# EAGLE design XibecaModuleBottom (EAGLE 9.6.2)
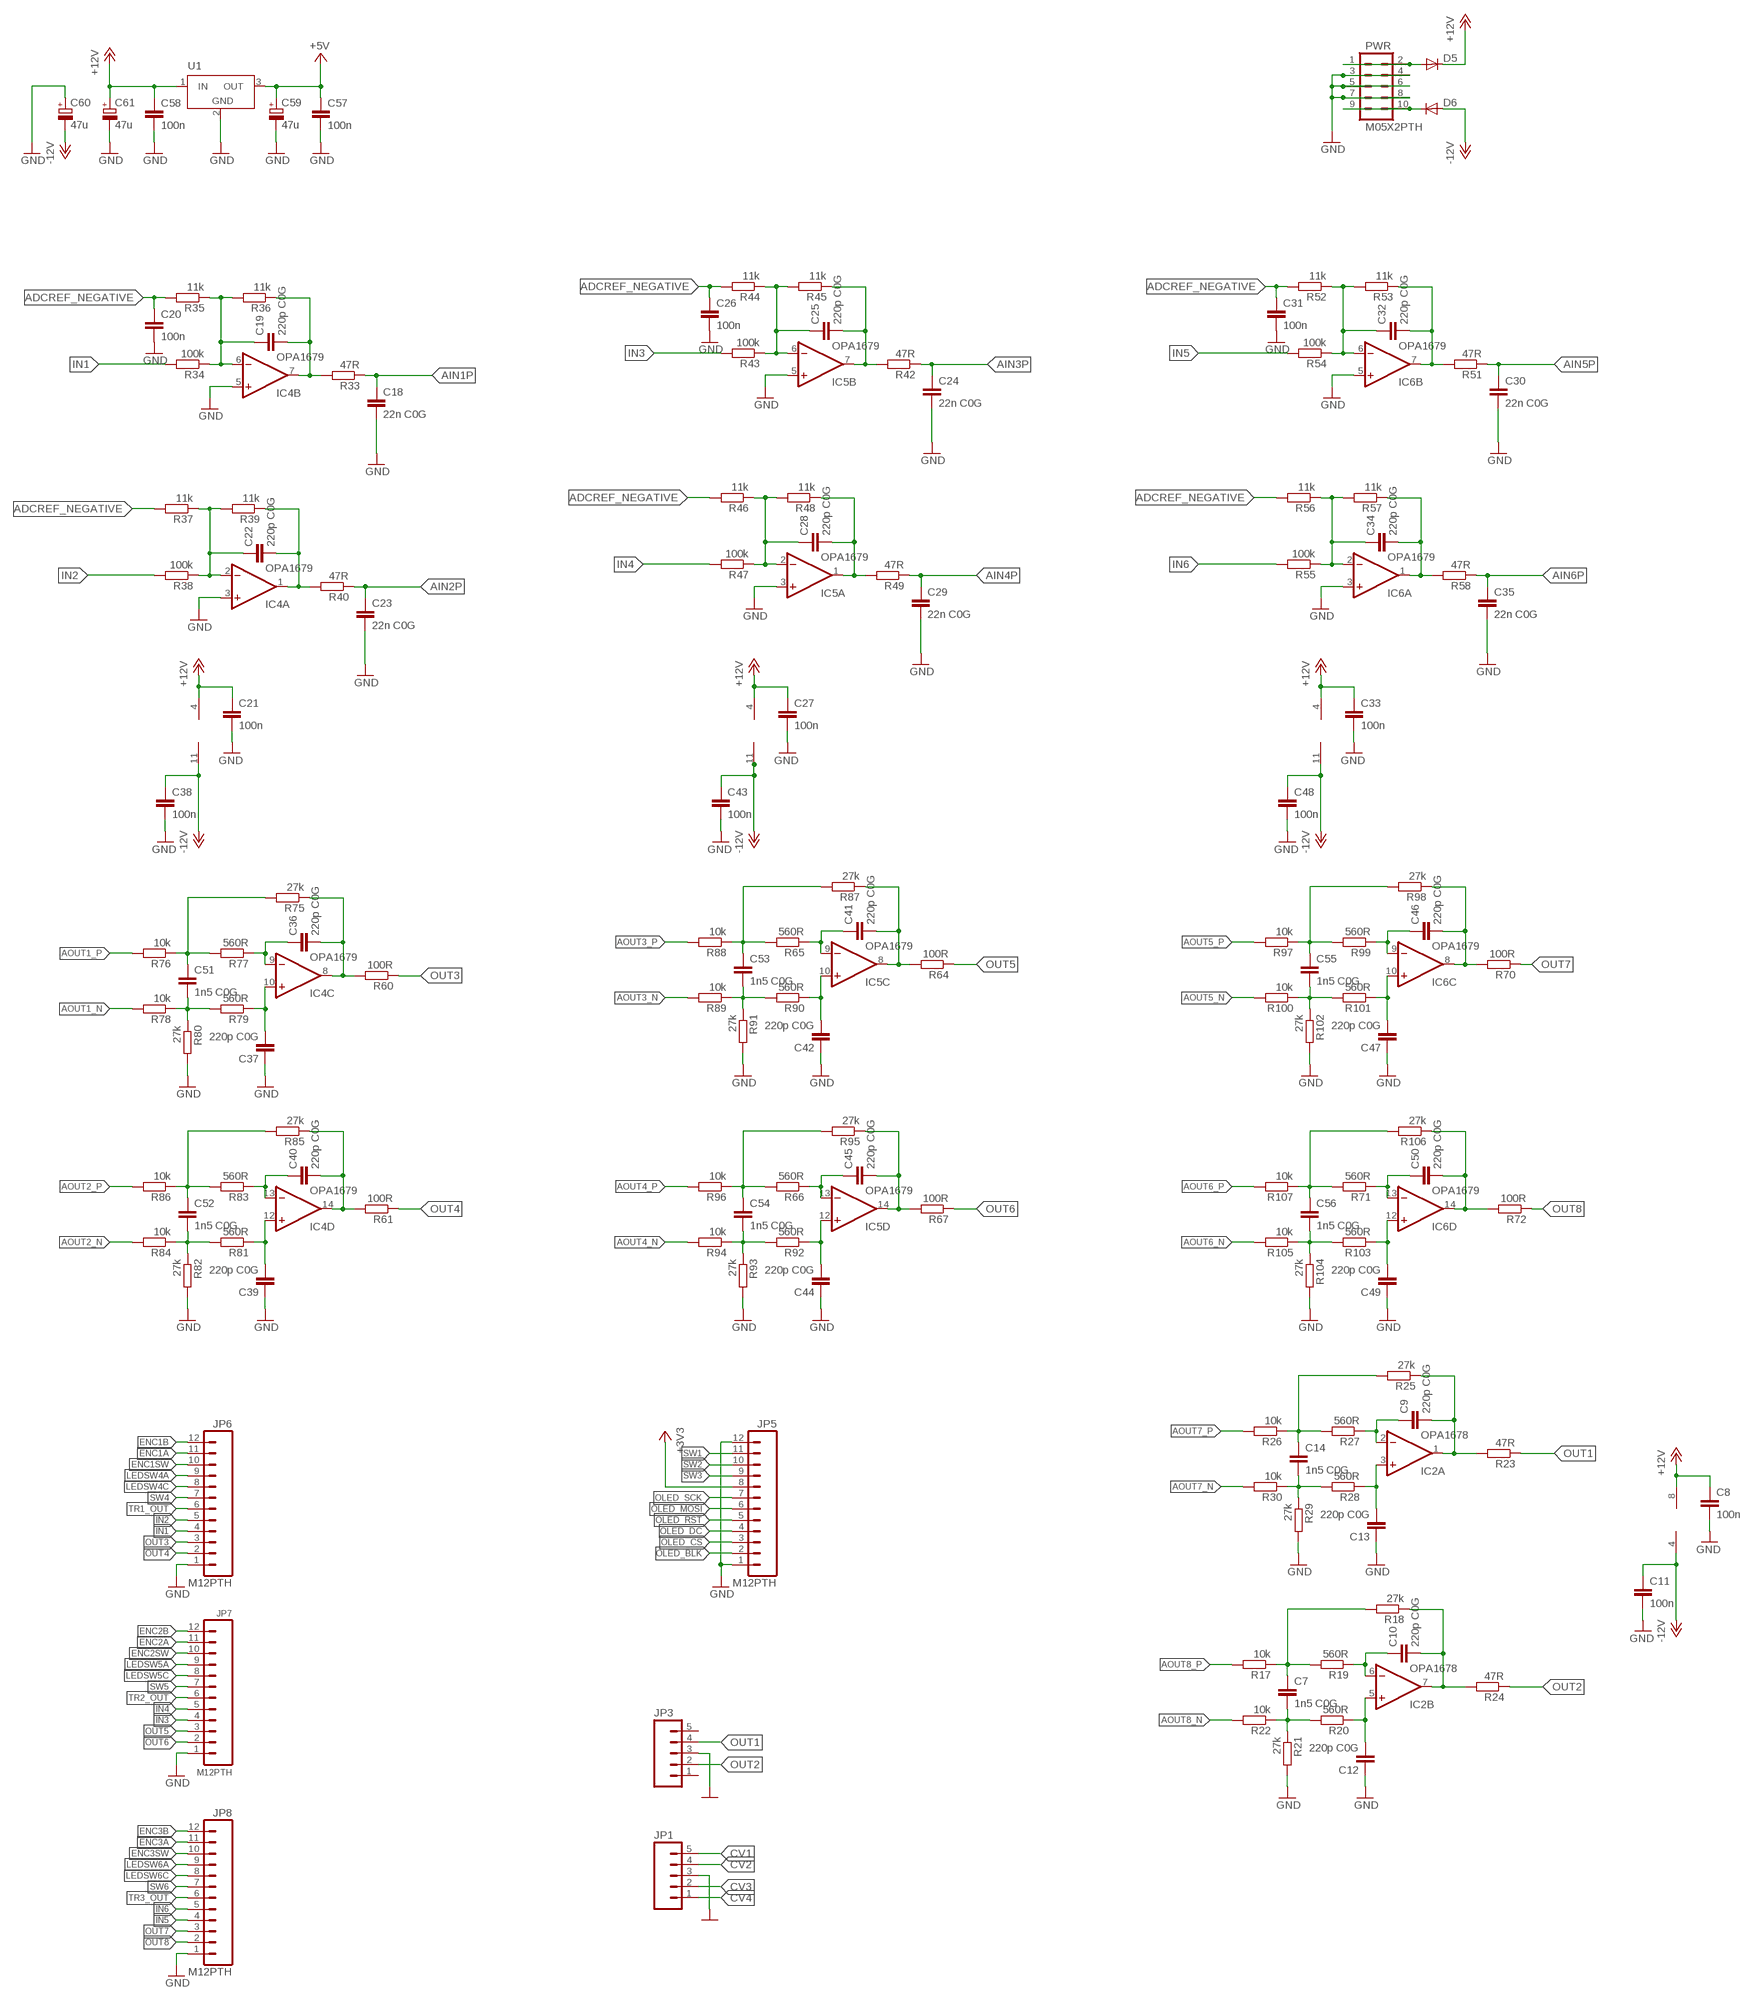
[diagram p0: schematic, sheet 1, part 1 of 2]
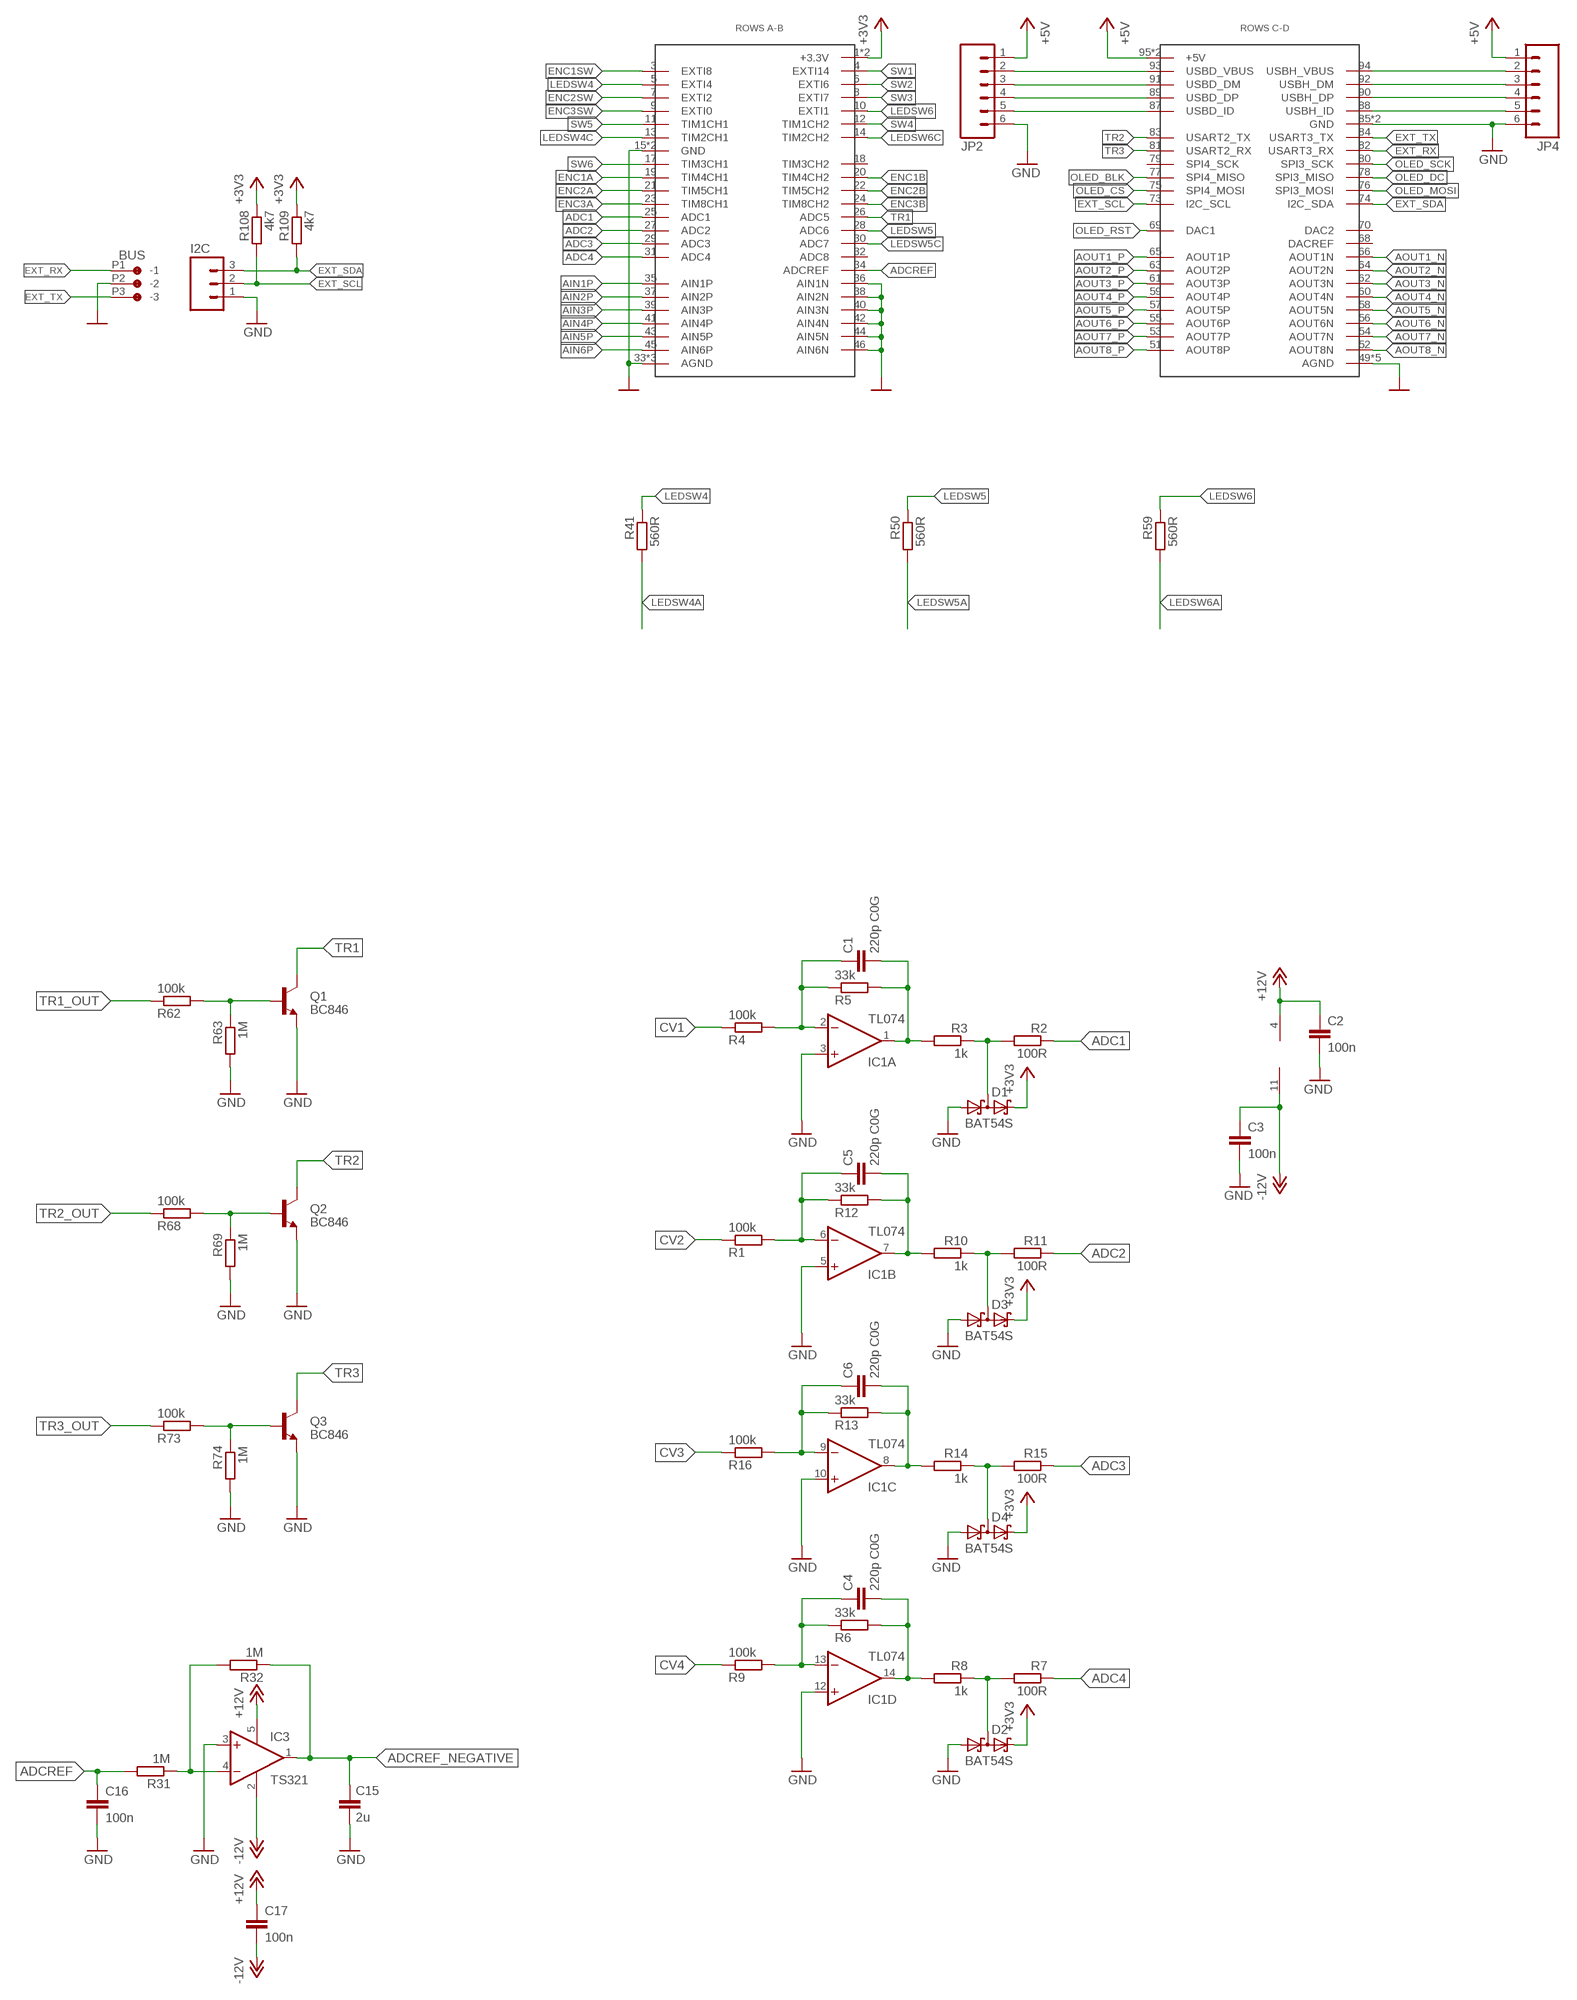
[diagram p1: schematic, sheet 1, part 2 of 2]

## Parts
BUS  CON-JST_PH_3W  [CON-JST_PH_3W]
C1  220p C0G  C-EUC0603  [C0603]
C2  100n  C-EUC0603  [C0603]
C3  100n  C-EUC0603  [C0603]
C4  220p C0G  C-EUC0603  [C0603]
C5  220p C0G  C-EUC0603  [C0603]
C6  220p C0G  C-EUC0603  [C0603]
C7  1n5 C0G  C-EUC0603  [C0603]
C8  100n  C-EUC0603  [C0603]
C9  220p C0G  C-EUC0603  [C0603]
C10  220p C0G  C-EUC0603  [C0603]
C11  100n  C-EUC0603  [C0603]
C12  220p C0G  C-EUC0603  [C0603]
C13  220p C0G  C-EUC0603  [C0603]
C14  1n5 C0G  C-EUC0603  [C0603]
C15  2u  C-EUC0603  [C0603]
C16  100n  C-EUC0603  [C0603]
C17  100n  C-EUC0603  [C0603]
C18  22n C0G  C-EUC0603  [C0603]
C19  220p C0G  C-EUC0603  [C0603]
C20  100n  C-EUC0603  [C0603]
C21  100n  C-EUC0603  [C0603]
C22  220p C0G  C-EUC0603  [C0603]
C23  22n C0G  C-EUC0603  [C0603]
C24  22n C0G  C-EUC0603  [C0603]
C25  220p C0G  C-EUC0603  [C0603]
C26  100n  C-EUC0603  [C0603]
C27  100n  C-EUC0603  [C0603]
C28  220p C0G  C-EUC0603  [C0603]
C29  22n C0G  C-EUC0603  [C0603]
C30  22n C0G  C-EUC0603  [C0603]
C31  100n  C-EUC0603  [C0603]
C32  220p C0G  C-EUC0603  [C0603]
C33  100n  C-EUC0603  [C0603]
C34  220p C0G  C-EUC0603  [C0603]
C35  22n C0G  C-EUC0603  [C0603]
C36  220p C0G  C-EUC0603  [C0603]
C37  220p C0G  C-EUC0603  [C0603]
C38  100n  C-EUC0603  [C0603]
C39  220p C0G  C-EUC0603  [C0603]
C40  220p C0G  C-EUC0603  [C0603]
C41  220p C0G  C-EUC0603  [C0603]
C42  220p C0G  C-EUC0603  [C0603]
C43  100n  C-EUC0603  [C0603]
C44  220p C0G  C-EUC0603  [C0603]
C45  220p C0G  C-EUC0603  [C0603]
C46  220p C0G  C-EUC0603  [C0603]
C47  220p C0G  C-EUC0603  [C0603]
C48  100n  C-EUC0603  [C0603]
C49  220p C0G  C-EUC0603  [C0603]
C50  220p C0G  C-EUC0603  [C0603]
C51  1n5 C0G  C-EUC0603  [C0603]
C52  1n5 C0G  C-EUC0603  [C0603]
C53  1n5 C0G  C-EUC0603  [C0603]
C54  1n5 C0G  C-EUC0603  [C0603]
C55  1n5 C0G  C-EUC0603  [C0603]
C56  1n5 C0G  C-EUC0603  [C0603]
C57  100n  C-EUC0603  [C0603]
C58  100n  C-EUC0603  [C0603]
C59  47u  CPOL-EUE5-8.5  [E5-8,5]
C60  47u  CPOL-EUE5-8.5  [E5-8,5]
C61  47u  CPOL-EUE5-8.5  [E5-8,5]
D1  BAT54S  [SOT23]
D2  BAT54S  [SOT23]
D3  BAT54S  [SOT23]
D4  BAT54S  [SOT23]
D5  DIODE1N4001  [DIODE-1N4001]
D6  DIODE1N4001  [DIODE-1N4001]
I2C  M03PTH  [1X03]
IC1  TL074  QUAD_OPAMPD  [SO14]
IC2  OPA1678  TL072D  [SO08]
IC3  TS321  OPA725DBV  [SOT23-5]
IC4  OPA1679  TL074D  [SO14]
IC5  OPA1679  TL074D  [SO14]
IC6  OPA1679  TL074D  [SO14]
JP1  M05PTH  [1X05]
JP2  M06SIP  [1X06]
JP3  M05PTH  [1X05]
JP4  M06SIP  [1X06]
JP5  M12PTH  [1X12]
JP6  M12PTH  [1X12]
JP7  M12PTH  [1X12]
JP8  M12PTH  [1X12]
PWR  M05X2PTH  [AVR_ICSP]
Q1  BC846  [SOT23]
Q2  BC846  [SOT23]
Q3  BC846  [SOT23]
R1  100k  R-EU_R0603  [0603]
R2  100R  R-EU_R0603  [0603]
R3  1k  R-EU_R0603  [0603]
R4  100k  R-EU_R0603  [0603]
R5  33k  R-EU_R0603  [0603]
R6  33k  R-EU_R0603  [0603]
R7  100R  R-EU_R0603  [0603]
R8  1k  R-EU_R0603  [0603]
R9  100k  R-EU_R0603  [0603]
R10  1k  R-EU_R0603  [0603]
R11  100R  R-EU_R0603  [0603]
R12  33k  R-EU_R0603  [0603]
R13  33k  R-EU_R0603  [0603]
R14  1k  R-EU_R0603  [0603]
R15  100R  R-EU_R0603  [0603]
R16  100k  R-EU_R0603  [0603]
R17  10k  R-EU_R0603  [0603]
R18  27k  R-EU_R0603  [0603]
R19  560R  R-EU_R0603  [0603]
R20  560R  R-EU_R0603  [0603]
R21  27k  R-EU_R0603  [0603]
R22  10k  R-EU_R0603  [0603]
R23  47R  R-EU_R0603  [0603]
R24  47R  R-EU_R0603  [0603]
R25  27k  R-EU_R0603  [0603]
R26  10k  R-EU_R0603  [0603]
R27  560R  R-EU_R0603  [0603]
R28  560R  R-EU_R0603  [0603]
R29  27k  R-EU_R0603  [0603]
R30  10k  R-EU_R0603  [0603]
R31  1M  R-EU_R0603  [0603]
R32  1M  R-EU_R0603  [0603]
R33  47R  R-EU_R0603  [0603]
R34  100k  R-EU_R0603  [0603]
R35  11k  R-EU_R0603  [0603]
R36  11k  R-EU_R0603  [0603]
R37  11k  R-EU_R0603  [0603]
R38  100k  R-EU_R0603  [0603]
R39  11k  R-EU_R0603  [0603]
R40  47R  R-EU_R0603  [0603]
R41  560R  R-EU_R0603  [0603]
R42  47R  R-EU_R0603  [0603]
R43  100k  R-EU_R0603  [0603]
R44  11k  R-EU_R0603  [0603]
R45  11k  R-EU_R0603  [0603]
R46  11k  R-EU_R0603  [0603]
R47  100k  R-EU_R0603  [0603]
R48  11k  R-EU_R0603  [0603]
R49  47R  R-EU_R0603  [0603]
R50  560R  R-EU_R0603  [0603]
R51  47R  R-EU_R0603  [0603]
R52  11k  R-EU_R0603  [0603]
R53  11k  R-EU_R0603  [0603]
R54  100k  R-EU_R0603  [0603]
R55  100k  R-EU_R0603  [0603]
R56  11k  R-EU_R0603  [0603]
R57  11k  R-EU_R0603  [0603]
R58  47R  R-EU_R0603  [0603]
R59  560R  R-EU_R0603  [0603]
R60  100R  R-EU_R0603  [0603]
R61  100R  R-EU_R0603  [0603]
R62  100k  R-EU_R0603  [0603]
R63  1M  R-EU_R0603  [0603]
R64  100R  R-EU_R0603  [0603]
R65  560R  R-EU_R0603  [0603]
R66  560R  R-EU_R0603  [0603]
R67  100R  R-EU_R0603  [0603]
R68  100k  R-EU_R0603  [0603]
R69  1M  R-EU_R0603  [0603]
R70  100R  R-EU_R0603  [0603]
R71  560R  R-EU_R0603  [0603]
R72  100R  R-EU_R0603  [0603]
R73  100k  R-EU_R0603  [0603]
R74  1M  R-EU_R0603  [0603]
R75  27k  R-EU_R0603  [0603]
R76  10k  R-EU_R0603  [0603]
R77  560R  R-EU_R0603  [0603]
R78  10k  R-EU_R0603  [0603]
R79  560R  R-EU_R0603  [0603]
R80  27k  R-EU_R0603  [0603]
R81  560R  R-EU_R0603  [0603]
R82  27k  R-EU_R0603  [0603]
R83  560R  R-EU_R0603  [0603]
R84  10k  R-EU_R0603  [0603]
R85  27k  R-EU_R0603  [0603]
R86  10k  R-EU_R0603  [0603]
R87  27k  R-EU_R0603  [0603]
R88  10k  R-EU_R0603  [0603]
R89  10k  R-EU_R0603  [0603]
R90  560R  R-EU_R0603  [0603]
R91  27k  R-EU_R0603  [0603]
R92  560R  R-EU_R0603  [0603]
R93  27k  R-EU_R0603  [0603]
R94  10k  R-EU_R0603  [0603]
R95  27k  R-EU_R0603  [0603]
R96  10k  R-EU_R0603  [0603]
R97  10k  R-EU_R0603  [0603]
R98  27k  R-EU_R0603  [0603]
R99  560R  R-EU_R0603  [0603]
R100  10k  R-EU_R0603  [0603]
R101  560R  R-EU_R0603  [0603]
R102  27k  R-EU_R0603  [0603]
R103  560R  R-EU_R0603  [0603]
R104  27k  R-EU_R0603  [0603]
R105  10k  R-EU_R0603  [0603]
R106  27k  R-EU_R0603  [0603]
R107  10k  R-EU_R0603  [0603]
R108  4k7  R-EU_R0603  [0603]
R109  4k7  R-EU_R0603  [0603]
U1  TSR-1-2450  [TSR-1-2450]
U$2  NOCTUA2NOCTUA2  [NOCTUA]

## Nets
+3V3: D1.2(C2) D2.2(C2) D3.2(C2) D4.2(C2) JP5.8 R108.1 R109.1 U$2.1(+3.3V) U$2.2(+3.3V)
+5V: C57.1 C59.+ JP2.1 JP4.1 U1.3(OUT) U$2.95(+5V) U$2.96(+5V)
+12V: C2.1 C8.1 C17.1 C21.1 C27.1 C33.1 C58.1 C61.+ D5.C IC1.4(P:V+) IC2.8(P:V+) IC3.5(V+) IC4.4(P:V+) IC5.4(P:V+) IC6.4(P:V+) U1.1(IN)
-12V: C3.1 C11.1 C17.2 C38.1 C43.1 C48.1 C60.- D6.A IC1.11(P:V-) IC2.4(P:V-) IC3.2(V-) IC4.11(P:V-) IC5.11(P:V-) IC6.11(P:V-)
ADC1: R2.1 U$2.25(ADC1)
ADC2: R11.1 U$2.27(ADC2)
ADC3: R15.1 U$2.29(ADC3)
ADC4: R7.1 U$2.31(ADC4)
ADCREF: C16.1 R31.2 U$2.34(ADCREF)
ADCREF_NEGATIVE: C15.1 C20.1 C26.1 C31.1 IC3.1(OUT) R32.1 R35.2 R37.2 R44.2 R46.2 R52.2 R56.2
AIN1P: C18.1 R33.1 U$2.35(AIN1P)
AIN2P: C23.1 R40.1 U$2.37(AIN2P)
AIN3P: C24.1 R42.1 U$2.39(AIN3P)
AIN4P: C29.1 R49.1 U$2.41(AIN4P)
AIN5P: C30.1 R51.1 U$2.43(AIN5P)
AIN6P: C35.1 R58.1 U$2.45(AIN6P)
AOUT1_N: R78.2 U$2.66(AOUT1N)
AOUT1_P: R76.2 U$2.65(AOUT1P)
AOUT2_N: R84.2 U$2.64(AOUT2N)
AOUT2_P: R86.2 U$2.63(AOUT2P)
AOUT3_N: R89.2 U$2.62(AOUT3N)
AOUT3_P: R88.2 U$2.61(AOUT3P)
AOUT4_N: R94.2 U$2.60(AOUT4N)
AOUT4_P: R96.2 U$2.59(AOUT4P)
AOUT5_N: R100.2 U$2.58(AOUT5N)
AOUT5_P: R97.2 U$2.57(AOUT5P)
AOUT6_N: R105.2 U$2.56(AOUT6N)
AOUT6_P: R107.2 U$2.55(AOUT6P)
AOUT7_N: R30.2 U$2.54(AOUT7N)
AOUT7_P: R26.2 U$2.53(AOUT7P)
AOUT8_N: R22.2 U$2.52(AOUT8N)
AOUT8_P: R17.2 U$2.51(AOUT8P)
CV1: JP1.5 R4.1
CV2: JP1.4 R1.1
CV3: JP1.2 R16.1
CV4: JP1.1 R9.1
ENC1A: JP6.11 U$2.19(TIM4CH1)
ENC1B: JP6.12 U$2.20(TIM4CH2)
ENC1SW: JP6.10 U$2.3(EXTI8)
ENC2A: JP7.11 U$2.21(TIM5CH1)
ENC2B: JP7.12 U$2.22(TIM5CH2)
ENC2SW: JP7.10 U$2.7(EXTI2)
ENC3A: JP8.11 U$2.23(TIM8CH1)
ENC3B: JP8.12 U$2.24(TIM8CH2)
ENC3SW: JP8.10 U$2.9(EXTI0)
EXT_RX: BUS.P1(-1) U$2.82(USART3_RX)
EXT_SCL: I2C.2 R108.2 U$2.73(I2C_SCL)
EXT_SDA: I2C.3 R109.2 U$2.74(I2C_SDA)
EXT_TX: BUS.P3(-3) U$2.84(USART3_TX)
GND: BUS.P2(-2) C2.2 C3.2 C8.2 C11.2 C12.1 C13.1 C15.2 C16.2 C18.2 C20.2 C21.2 C23.2 C24.2 C26.2 C27.2 C29.2 C30.2 C31.2 C33.2 C35.2 C37.1 C38.2 C39.1 C42.1 C43.2 C44.1 C47.1 C48.2 C49.1 C57.2 C58.2 C59.- C60.+ C61.- D1.1(A1) D2.1(A1) D3.1(A1) D4.1(A1) I2C.1 IC1.3(A:+IN) IC1.5(B:+IN) IC1.10(C:+IN) IC1.12(D:+IN) IC3.3(+IN) IC4.3(A:+IN) IC4.5(B:+IN) IC5.3(A:+IN) IC5.5(B:+IN) IC6.3(A:+IN) IC6.5(B:+IN) JP1.3 JP2.6 JP3.3 JP4.6 JP5.1 JP5.12 JP6.1 JP7.1 JP8.1 PWR.3 PWR.4 PWR.5 PWR.6 PWR.7 PWR.8 Q1.2(E) Q2.2(E) Q3.2(E) R21.2 R29.2 R63.2 R69.2 R74.2 R80.2 R82.2 R91.2 R93.2 R102.2 R104.2 U1.2(GND) U$2.15(GND) U$2.16(GND) U$2.33(AGND) U$2.36(AIN1N) U$2.38(AIN2N) U$2.40(AIN3N) U$2.42(AIN4N) U$2.44(AIN5N) U$2.46(AIN6N) U$2.47(AGND) U$2.48(AGND) U$2.49(AGND) U$2.50(AGND) U$2.67(AGND) U$2.71(AGND) U$2.72(AGND) U$2.85(GND) U$2.86(GND)
IN1: JP6.4 R34.2
IN2: JP6.5 R38.2
IN3: JP7.4 R43.2
IN4: JP7.5 R47.2
IN5: JP8.4 R54.2
IN6: JP8.5 R55.2
LEDSW4: R41.1 U$2.5(EXTI4)
LEDSW4A: JP6.9 R41.2
LEDSW4C: JP6.8 U$2.13(TIM2CH1)
LEDSW5: R50.1 U$2.28(ADC6)
LEDSW5A: JP7.9 R50.2
LEDSW5C: JP7.8 U$2.30(ADC7)
LEDSW6: R59.1 U$2.10(EXTI1)
LEDSW6A: JP8.9 R59.2
LEDSW6C: JP8.8 U$2.14(TIM2CH2)
N$1: C40.2 IC4.14(D:OUT) R61.2 R85.1
N$2: C52.2 R81.2 R82.1 R84.1
N$3: C52.1 R83.2 R85.2 R86.1
N$4: C22.2 IC4.1(A:OUT) R39.1 R40.2
N$5: C40.1 IC4.13(D:-IN) R83.1
N$6: C22.1 IC4.2(A:-IN) R37.1 R38.1 R39.2
N$7: D6.C PWR.9 PWR.10
N$8: C39.2 IC4.12(D:+IN) R81.1
N$9: D5.A PWR.1 PWR.2
N$10: C50.2 IC6.14(D:OUT) R72.2 R106.1
N$11: C53.2 R89.1 R90.2 R91.1
N$12: C53.1 R65.2 R87.2 R88.1
N$13: C41.1 IC5.9(C:-IN) R65.1
N$14: C42.2 IC5.10(C:+IN) R90.1
N$15: C41.2 IC5.8(C:OUT) R64.2 R87.1
N$16: C45.2 IC5.14(D:OUT) R67.2 R95.1
N$17: C25.2 IC5.7(B:OUT) R42.2 R45.1
N$18: C25.1 IC5.6(B:-IN) R43.1 R44.1 R45.2
N$20: C28.2 IC5.1(A:OUT) R48.1 R49.2
N$21: C28.1 IC5.2(A:-IN) R46.1 R47.1 R48.2
N$22: C46.2 IC6.8(C:OUT) R70.2 R98.1
N$23: C54.2 R92.2 R93.1 R94.1
N$24: C54.1 R66.2 R95.2 R96.1
N$25: C45.1 IC5.13(D:-IN) R66.1
N$26: C44.2 IC5.12(D:+IN) R92.1
N$27: IC3.4(-IN) R31.1 R32.2
N$28: C9.2 IC2.1(A:OUT) R23.2 R25.1
N$29: C14.2 R28.2 R29.1 R30.1
N$30: Q1.1(B) R62.2 R63.1
N$31: C14.1 R25.2 R26.1 R27.2
N$32: C10.2 IC2.7(B:OUT) R18.1 R24.2
N$35: C55.2 R100.1 R101.2 R102.1
N$36: C55.1 R97.1 R98.2 R99.2
N$37: C46.1 IC6.9(C:-IN) R99.1
N$38: C47.2 IC6.10(C:+IN) R101.1
N$39: C36.2 IC4.8(C:OUT) R60.2 R75.1
N$40: Q2.1(B) R68.2 R69.1
N$41: C32.2 IC6.7(B:OUT) R51.2 R53.1
N$42: C32.1 IC6.6(B:-IN) R52.1 R53.2 R54.1
N$44: C34.2 IC6.1(A:OUT) R57.1 R58.2
N$45: C34.1 IC6.2(A:-IN) R55.1 R56.1 R57.2
N$47: C56.2 R103.2 R104.1 R105.1
N$48: C56.1 R71.2 R106.2 R107.1
N$49: C50.1 IC6.13(D:-IN) R71.1
N$50: C49.2 IC6.12(D:+IN) R103.1
N$52: C5.1 IC1.6(B:-IN) R1.2 R12.1
N$57: C1.1 IC1.2(A:-IN) R4.2 R5.1
N$59: Q3.1(B) R73.2 R74.1
N$60: C9.1 IC2.2(A:-IN) R27.1
N$61: C13.2 IC2.3(A:+IN) R28.1
N$63: C7.2 R20.2 R21.1 R22.1
N$64: C7.1 R17.1 R18.2 R19.2
N$65: C10.1 IC2.6(B:-IN) R19.1
N$66: C12.2 IC2.5(B:+IN) R20.1
N$68: C1.2 IC1.1(A:OUT) R3.2 R5.2
N$69: D1.3(C1A2) R2.2 R3.1
N$70: C5.2 IC1.7(B:OUT) R10.2 R12.2
N$71: D3.3(C1A2) R10.1 R11.2
N$72: C6.1 IC1.9(C:-IN) R13.1 R16.2
N$73: C6.2 IC1.8(C:OUT) R13.2 R14.2
N$74: D4.3(C1A2) R14.1 R15.2
N$75: C4.1 IC1.13(D:-IN) R6.1 R9.2
N$76: C4.2 IC1.14(D:OUT) R6.2 R8.2
N$77: D2.3(C1A2) R7.2 R8.1
N$78: JP2.2 U$2.93(USBD_VBUS)
N$79: JP2.3 U$2.91(USBD_DM)
N$80: JP2.4 U$2.89(USBD_DP)
N$81: JP2.5 U$2.87(USBD_ID)
N$82: JP4.5 U$2.88(USBH_ID)
N$83: JP4.4 U$2.90(USBH_DP)
N$84: JP4.3 U$2.92(USBH_DM)
N$85: JP4.2 U$2.94(USBH_VBUS)
N$214: C51.2 R78.1 R79.2 R80.1
N$215: C51.1 R75.2 R76.1 R77.2
N$216: C36.1 IC4.9(C:-IN) R77.1
N$217: C37.2 IC4.10(C:+IN) R79.1
N$220: C19.2 IC4.7(B:OUT) R33.2 R36.1
N$223: C19.1 IC4.6(B:-IN) R34.1 R35.1 R36.2
OLED_BLK: JP5.2 U$2.77(SPI4_MISO)
OLED_CS: JP5.3 U$2.75(SPI4_MOSI)
OLED_DC: JP5.4 U$2.78(SPI3_MISO)
OLED_MOSI: JP5.6 U$2.76(SPI3_MOSI)
OLED_RST: JP5.5 U$2.69(DAC1)
OLED_SCK: JP5.7 U$2.80(SPI3_SCK)
OUT1: JP3.4 R23.1
OUT2: JP3.2 R24.1
OUT3: JP6.3 R60.1
OUT4: JP6.2 R61.1
OUT5: JP7.3 R64.1
OUT6: JP7.2 R67.1
OUT7: JP8.3 R70.1
OUT8: JP8.2 R72.1
SW1: JP5.11 U$2.4(EXTI14)
SW2: JP5.10 U$2.6(EXTI6)
SW3: JP5.9 U$2.8(EXTI7)
SW4: JP6.7 U$2.12(TIM1CH2)
SW5: JP7.7 U$2.11(TIM1CH1)
SW6: JP8.7 U$2.17(TIM3CH1)
TR1: Q1.3(C) U$2.26(ADC5)
TR1_OUT: JP6.6 R62.1
TR2: Q2.3(C) U$2.83(USART2_TX)
TR2_OUT: JP7.6 R68.1
TR3: Q3.3(C) U$2.81(USART2_RX)
TR3_OUT: JP8.6 R73.1
Unconnected: JP3.1 JP3.5 U$2.18(TIM3CH2) U$2.32(ADC8) U$2.68(DACREF) U$2.70(DAC2) U$2.79(SPI4_SCK)

## Library data of the parts
BUS = Rebel:CON-JST_PH_3W
C1-C58 = Rebel:C-EU: CAPACITOR, European symbol
C59-C61 = Rebel:CPOL-EU: POLARIZED CAPACITOR, European symbol
D1-D4 = diode:BAT54S: Schottky Diodes Pin connection corrected 2011-05-04 Source: Fairchild .. BAT54.pdf
D5 D6 = Rebel:DIODE: Diode These are standard reverse protection diodes and small signal diodes. SMA package can handle up to about 1A. SOD-323 can handle about 200mA. Watch the SOD-323 package when ordering, there are some mfgs out there that are 5-pin packages.
I2C = SparkFun:M03: Header 3 Standard 3-pin 0.1" header. Use with straight break away headers (SKU : PRT-00116), right angle break away headers (PRT-00553), swiss pins (PRT-00743), machine pins (PRT-00117), and female headers (PRT-00115). Molex polarized connector foot print use with SKU : PRT-08232 with associated crimp pins and housings.
IC1 = adafruit:QUAD_OPAMP: OP AMP Standard quad package
IC2 = linear:TL072: OP AMP
IC3 = linear:OPA725: Very Low Noise, High-Speed, 12V CMOS Operational Amplifier Source: http://focus.ti.com/lit/ds/symlink/opa725.pdf
IC4-IC6 = Rebel:TL074: OP AMP
JP1 JP3 = SparkFun:M05: Header 5 Standard 5-pin 0.1" header. Use with straight break away headers (SKU : PRT-00116), right angle break away headers (PRT-00553), swiss pins (PRT-00743), machine pins (PRT-00117), and female headers (PRT-00115). Molex polarized connector foot print use with SKU : PRT-08230 with associated crimp pins and housings.
JP2 JP4 = SparkFun:M06: Header 6 Standard 6-pin 0.1" header. Use with straight break away headers (SKU : PRT-00116), right angle break away headers (PRT-00553), swiss pins (PRT-00743), machine pins (PRT-00117), and female headers (PRT-00115). Molex polarized connector foot print use with SKU : PRT-08094 with associated crimp pins and housings. NOTES ON THE VARIANTS LOCK and LOCK_LONGPADS... This footprint was designed to help hold the alignment of a through-hole component (i.e. 6-pin header) while soldering it into place. You may notice that each hole has been shifted either up or down by 0.005 of an inch from it's more standard position (which is a perfectly straight line). This slight alteration caused the pins (the squares in the middle) to touch the edges of the holes. Because they are alternating, it causes a "brace" to hold the component in place. 0.005 has proven to be the perfect amount of "off-center" position when using our standard breakaway headers. Although looks a little odd when you look at the bare footprint, once you have a header in there, the alteration is very hard to notice. Also, if you push a header all the way into place, it is covered up entirely on the bottom side. This idea of altering the position of holes to aid alignment will be further integrated into the Sparkfun Library for other footprints. It can help hold any component with 3 or more connection pins.
JP5-JP8 = SparkFun:M12: Header 12 Standard 12-pin 0.1" header. Use with straight break away headers (SKU : PRT-00116), right angle break away headers (PRT-00553), swiss pins (PRT-00743), machine pins (PRT-00117), and female headers (PRT-00115).
PWR = SparkFun:M05X2: Header 5x2 Standard 10-pin dual row 0.1" header. Commonly used with AVR-ISP. Use with Spark Fun Electronics SKU: PRT-00778
Q1-Q3 = transistor:BC846: NPN TRANSISTOR
R1-R109 = Rebel:R-EU_: RESISTOR, European symbol
U1 = Hangar:TSR-1-2450
U$2 = Rebel platforms:NOCTUA2

## Net classes
1 power: width 0.178 mm, drill 0.305 mm, clearance 0.178 mm to class 0, clearance 0.178 mm

## Board
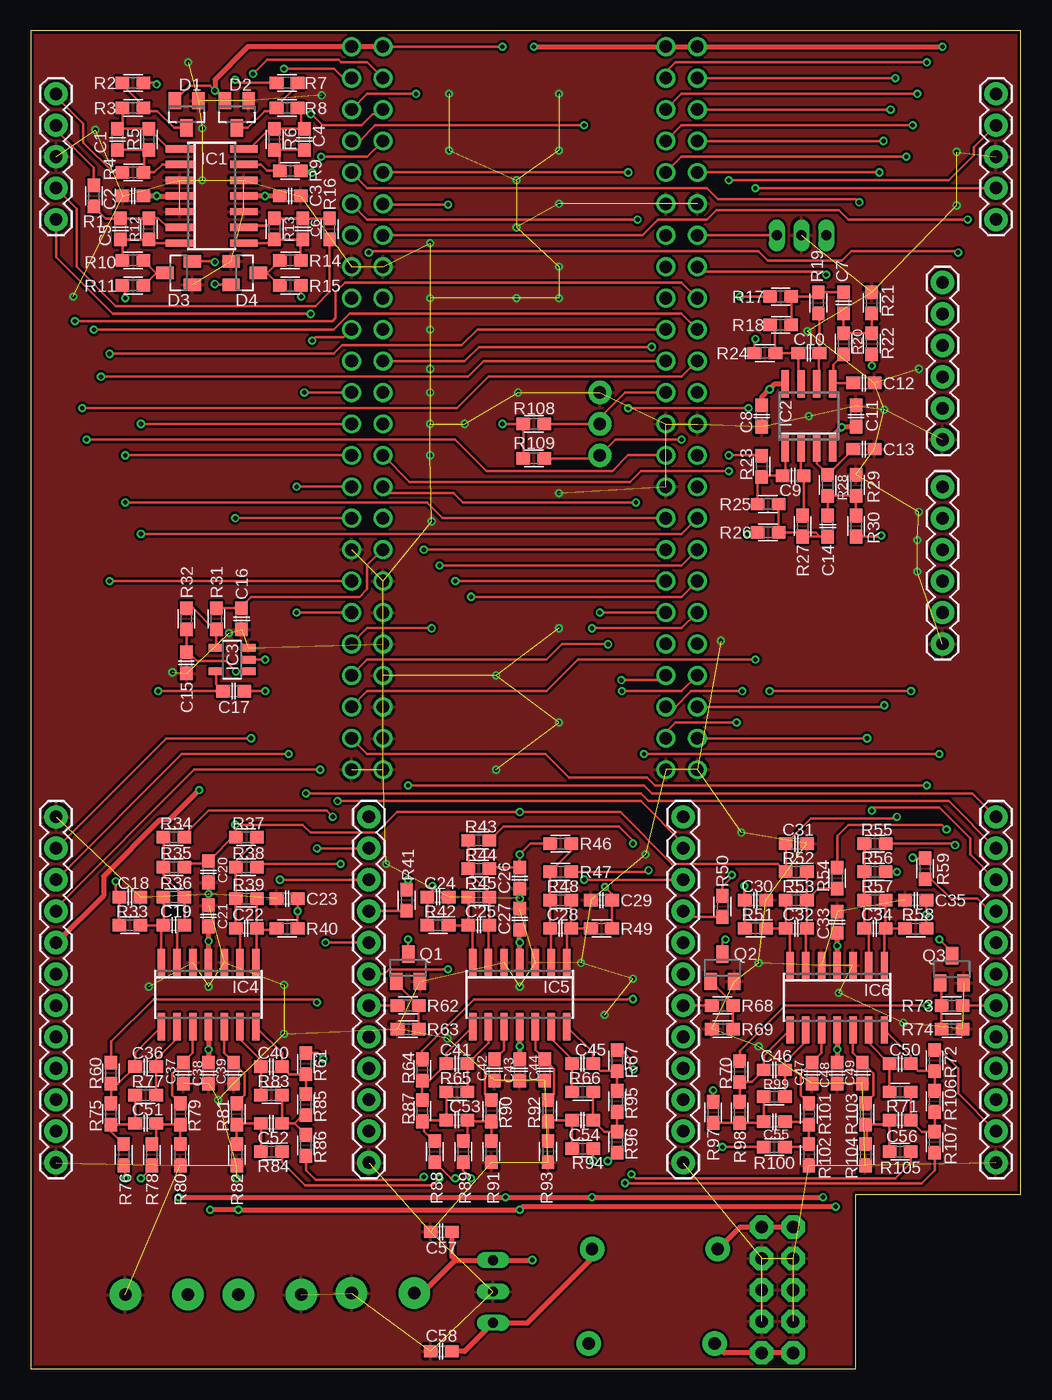
[diagram p2: board, top side]
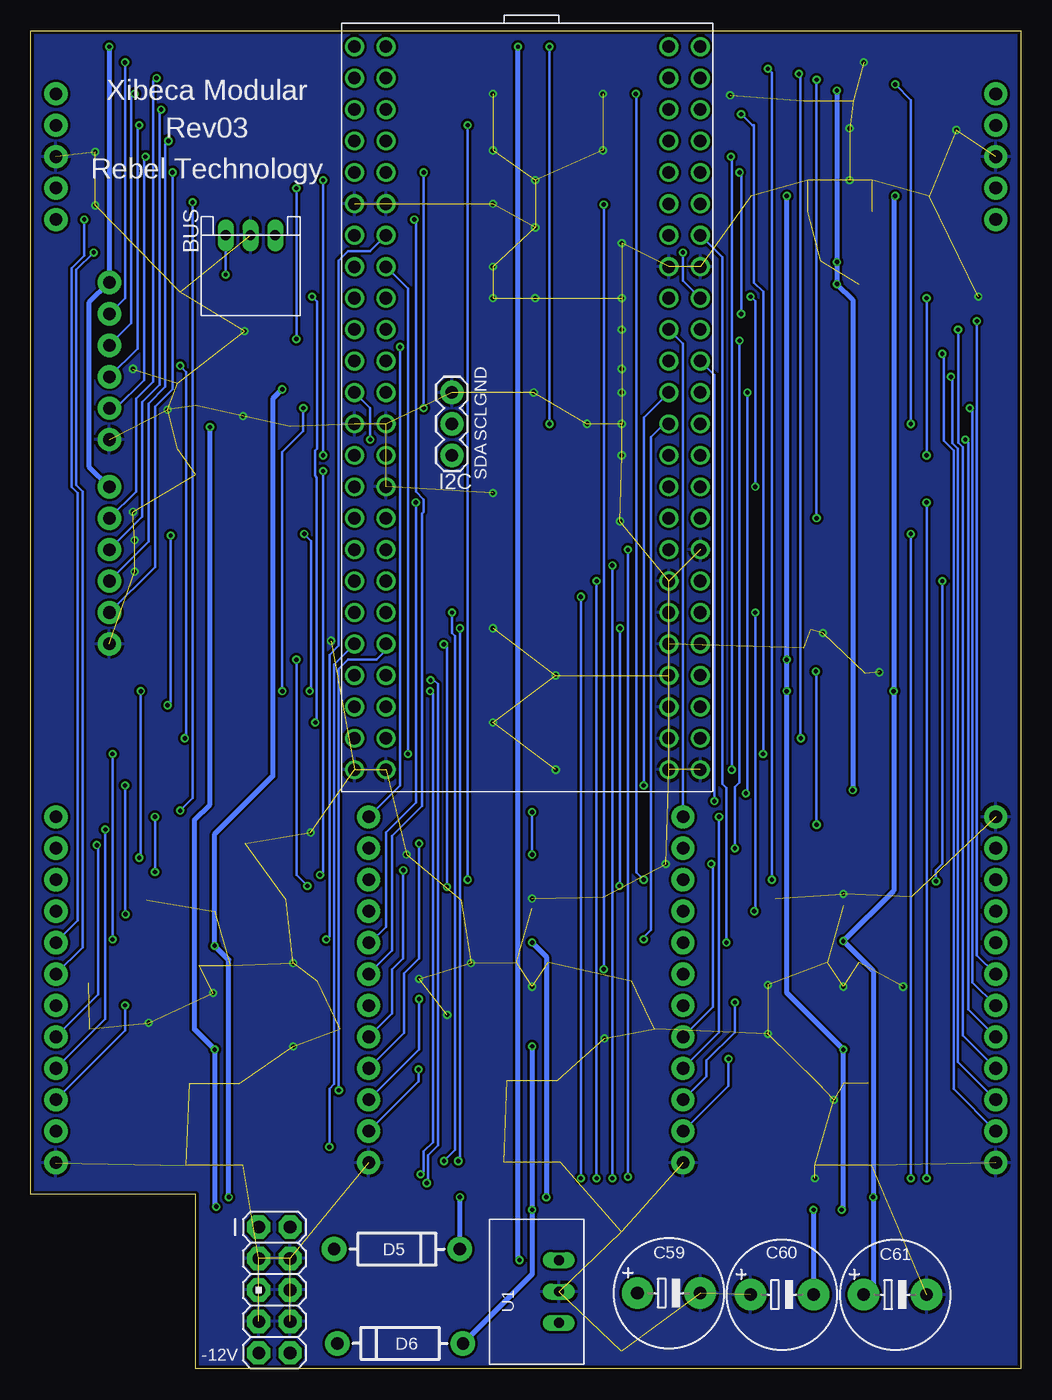
[diagram p3: board, bottom side, seen from below]

Size 80 x 108.08 mm. Coordinates in mm from the lower left corner, seen from the top.
Outline: 0,108.08 0,0 66.67,0 66.67,14.1 80,14.1 80,108.08 0,108.08
Copper layers (1*16): Top 0.035mm / dielectric 1.5mm / Bottom 0.035mm
Design rules "Fusion_eagle_rule_v1.1": minimum track width 6mil, minimum drill 12mil, track to track 6mil, track to pad 6mil, pad to pad 6mil, via to via 6mil, smd to smd 0mil, copper to edge 10mil, drill to drill 10mil, minimum pad ring 10mil, minimum via ring 6mil, stop-mask expansion 2mil, vias tented up to drill 100mil, thermal gap 10mil

### Footprints (pad centres in the part's own frame; a part is rotated, then mirrored left to right if it is on the bottom)
CON-JST_PH_3W = drill 0.8 long: P1 0,0; P2 -2,0; P3 -4,0
C0603 = smd 1.1 x 1: 1 -0.85,0; 2 0.85,0
E5-8,5 = drill 1.016 pad 2.54: + -2.54,0; - 2.54,0
SOT23 = smd 1 x 1.4: 1 -0.95,-1.1; 2 0.95,-1.1; 3 0,1.1
DIODE-1N4001 = drill 1 pad 1.981: A -5.08,0; C 5.08,0
1X03 = drill 1.016 pad 1.88: 1 0,0; 2 2.54,0; 3 5.08,0
SO14 = smd 0.6 x 2.2: 1 -3.81,-2.6; 2 -2.54,-2.6; 3 -1.27,-2.6; 4 0,-2.6; 5 1.27,-2.6; 6 2.54,-2.6; 7 3.81,-2.6; 8 3.81,2.6; 9 2.54,2.6; 10 1.27,2.6; 11 0,2.6; 12 -1.27,2.6; 13 -2.54,2.6; 14 -3.81,2.6
SO08 = smd 0.6 x 2.2: 1 -1.905,-2.6; 2 -0.635,-2.6; 3 0.635,-2.6; 4 1.905,-2.6; 5 1.905,2.6; 6 0.635,2.6; 7 -0.635,2.6; 8 -1.905,2.6
SOT23-5 = smd 0.6 x 1.2: 1 -0.95,-1.306; 2 0,-1.306; 3 0.95,-1.306; 4 0.95,1.306; 5 -0.95,1.306
1X05 = drill 1.016 pad 1.88: 1 0,0; 2 2.54,0; 3 5.08,0; 4 7.62,0; 5 10.16,0
1X06 = drill 1.016 pad 1.88: 1 0,0; 2 2.54,0; 3 5.08,0; 4 7.62,0; 5 10.16,0; 6 12.7,0
1X12 = drill 1.016 pad 1.88: 1 0,0; 2 2.54,0; 3 5.08,0; 4 7.62,0; 5 10.16,0; 6 12.7,0; 7 15.24,0; 8 17.78,0; 9 20.32,0; 10 22.86,0; 11 25.4,0; 12 27.94,0
AVR_ICSP = drill 1.016 pad 1.88 octagon: 1 -1.27,5.08; 2 1.27,5.08; 3 -1.27,2.54; 4 1.27,2.54; 5 -1.27,0; 6 1.27,0; 7 -1.27,-2.54; 8 1.27,-2.54; 9 -1.27,-5.08; 10 1.27,-5.08
0603 = smd 1.1 x 1: 1 -0.85,0; 2 0.85,0
TSR-1-2450 = drill 0.8 long: 1 -2.54,0; 2 0,0; 3 2.54,0
NOCTUA = drill 1.016: 1 13.97,26.67; 2 11.43,26.67; 3 13.97,24.13; 4 11.43,24.13; 5 13.97,21.59; 6 11.43,21.59; 7 13.97,19.05; 8 11.43,19.05; 9 13.97,16.51; 10 11.43,16.51; 11 13.97,13.97; 12 11.43,13.97; 13 13.97,11.43; 14 11.43,11.43; 15 13.97,8.89; 16 11.43,8.89; 17 13.97,6.35; 18 11.43,6.35; 19 13.97,3.81; 20 11.43,3.81; 21 13.97,1.27; 22 11.43,1.27; 23 13.97,-1.27; 24 11.43,-1.27; 25 13.97,-3.81; 26 11.43,-3.81; 27 13.97,-6.35; 28 11.43,-6.35; 29 13.97,-8.89; 30 11.43,-8.89; 31 13.97,-11.43; 32 11.43,-11.43; 33 13.97,-13.97; 34 11.43,-13.97; 35 13.97,-16.51; 36 11.43,-16.51; 37 13.97,-19.05; 38 11.43,-19.05; 39 13.97,-21.59; 40 11.43,-21.59; 41 13.97,-24.13; 42 11.43,-24.13; 43 13.97,-26.67; 44 11.43,-26.67; 45 13.97,-29.21; 46 11.43,-29.21; 47 13.97,-31.75; 48 11.43,-31.75; 49 -11.43,-31.75; 50 -13.97,-31.75; 51 -11.43,-29.21; 52 -13.97,-29.21; 53 -11.43,-26.67; 54 -13.97,-26.67; 55 -11.43,-24.13; 56 -13.97,-24.13; 57 -11.43,-21.59; 58 -13.97,-21.59; 59 -11.43,-19.05; 60 -13.97,-19.05; 61 -11.43,-16.51; 62 -13.97,-16.51; 63 -11.43,-13.97; 64 -13.97,-13.97; 65 -11.43,-11.43; 66 -13.97,-11.43; 67 -11.43,-8.89; 68 -13.97,-8.89; 69 -11.43,-6.35; 70 -13.97,-6.35; 71 -11.43,-3.81; 72 -13.97,-3.81; 73 -11.43,-1.27; 74 -13.97,-1.27; 75 -11.43,1.27; 76 -13.97,1.27; 77 -11.43,3.81; 78 -13.97,3.81; 79 -11.43,6.35; 80 -13.97,6.35; 81 -11.43,8.89; 82 -13.97,8.89; 83 -11.43,11.43; 84 -13.97,11.43; 85 -11.43,13.97; 86 -13.97,13.97; 87 -11.43,16.51; 88 -13.97,16.51; 89 -11.43,19.05; 90 -13.97,19.05; 91 -11.43,21.59; 92 -13.97,21.59; 93 -11.43,24.13; 94 -13.97,24.13; 95 -11.43,26.67; 96 -13.97,26.67

### Placement (x,y rotation side)
BUS  64.26,91.57 180 bottom
C1  6.99,99.31 90 top
C2  8.26,94.74 180 top
C3  20.95,94.74 0 top
C4  22.1,99.31 90 top
C5  7.24,92.08 270 top
C6  21.97,92.08 270 top
C7  65.66,86.11 270 top
C8  59.05,76.96 270 top
C9  61.59,72.14 180 top
C10  62.87,82.04 180 top
C11  66.67,76.96 90 top
C12  67.31,79.63 180 top
C13  67.31,74.3 180 top
C14  64.39,68.07 90 top
C15  12.57,57.02 270 top
C16  17.02,60.58 270 top
C17  16.38,54.74 0 top
C18  8,38.1 0 top
C19  11.56,35.81 180 top
C20  14.35,40.13 270 top
C21  14.35,36.58 90 top
C22  17.4,35.56 0 top
C23  20.7,37.97 180 top
C24  32.89,38.1 0 top
C25  36.2,35.81 180 top
C26  39.5,39.62 270 top
C27  39.5,36.32 90 top
C28  42.8,35.56 0 top
C29  46.1,37.85 180 top
C30  58.55,37.85 0 top
C31  61.85,42.42 0 top
C32  61.85,35.56 180 top
C33  65.15,36.07 90 top
C34  68.2,35.56 0 top
C35  71.5,37.85 180 top
C36  9.27,24.38 180 top
C37  12.32,23.88 90 top
C38  14.35,23.88 270 top
C39  16.38,23.88 90 top
C40  19.43,24.38 0 top
C41  34.42,24.64 180 top
C42  37.47,24.13 90 top
C43  39.5,24.13 270 top
C44  41.53,24.13 90 top
C45  44.58,24.64 0 top
C46  60.07,24.13 180 top
C47  63.12,23.88 90 top
C48  65.15,23.88 270 top
C49  67.18,23.88 90 top
C50  70.23,24.64 0 top
C51  9.27,19.81 0 top
C52  19.43,19.81 180 top
C53  34.42,20.07 0 top
C54  44.58,20.07 180 top
C55  60.07,19.94 0 top
C56  70.23,20.07 180 top
C57  33.15,11.05 180 top
C58  33.15,1.4 180 top
C59  28.45,6.1 0 bottom
C60  19.3,5.97 0 bottom
C61  10.16,5.97 0 bottom
D1  12.57,101.35 180 top
D2  16.64,101.35 180 top
D3  11.94,88.52 90 top
D4  17.27,88.52 270 top
D5  50.42,9.65 0 bottom
D6  50.16,2.03 180 bottom
I2C  45.97,78.87 270 bottom
IC1  14.61,94.74 270 top
IC2  62.87,76.96 0 top
IC3  16.26,57.28 90 top
IC4  14.35,30.23 180 top
IC5  39.5,30.23 180 top
IC6  65.15,29.97 180 top
JP1  2.03,92.84 90 top
JP2  73.66,87.76 270 top
JP3  77.98,92.84 90 top
JP4  73.66,71.25 270 top
JP5  2.03,16.64 90 top
JP6  27.3,16.64 90 top
JP7  52.7,16.64 90 top
JP8  77.98,16.64 90 top
PWR  60.33,6.35 0 bottom
Q1  30.48,32.39 0 top
Q2  55.88,32.39 0 top
Q3  74.42,32.26 0 top
R1  5.08,94.74 270 top
R2  8.26,103.89 180 top
R3  8.26,101.85 180 top
R4  8.26,96.65 0 top
R5  9.53,99.31 90 top
R6  19.68,99.31 90 top
R7  20.7,103.89 0 top
R8  20.7,101.85 0 top
R9  20.95,96.77 180 top
R10  8.26,89.53 180 top
R11  8.26,87.5 0 top
R12  9.53,92.08 270 top
R13  19.68,92.08 270 top
R14  20.95,89.53 0 top
R15  20.95,87.5 180 top
R16  24.13,92.08 90 top
R17  60.58,86.61 180 top
R18  60.58,84.33 0 top
R19  63.63,86.11 90 top
R20  65.66,82.8 90 top
R21  67.94,86.11 90 top
R22  67.94,82.8 270 top
R23  59.05,72.9 270 top
R24  59.31,82.04 0 top
R25  59.56,69.85 0 top
R26  59.56,67.56 180 top
R27  62.36,68.07 270 top
R28  64.39,71.37 270 top
R29  66.67,71.37 90 top
R30  66.67,68.07 270 top
R31  14.99,60.58 90 top
R32  12.57,60.58 90 top
R33  8,35.81 0 top
R34  11.56,42.93 0 top
R35  11.56,40.51 0 top
R36  11.56,38.1 0 top
R37  17.4,42.93 180 top
R38  17.4,40.51 0 top
R39  17.4,37.97 180 top
R40  20.7,35.56 180 top
R41  30.35,37.85 270 top
R42  32.89,35.81 0 top
R43  36.2,42.67 0 top
R44  36.2,40.39 0 top
R45  36.2,38.1 0 top
R46  42.8,42.42 180 top
R47  42.8,40.13 0 top
R48  42.8,37.85 180 top
R49  46.1,35.56 180 top
R50  55.88,37.34 270 top
R51  58.55,35.56 0 top
R52  61.85,40.13 180 top
R53  61.85,37.85 0 top
R54  65.15,39.62 90 top
R55  68.2,42.42 0 top
R56  68.2,40.13 0 top
R57  68.2,37.85 180 top
R58  71.5,35.56 180 top
R59  72.26,40.39 270 top
R60  6.48,23.88 270 top
R61  22.23,24.64 270 top
R62  30.48,29.34 0 top
R63  30.48,27.43 180 top
R64  31.62,24.13 270 top
R65  34.42,22.35 180 top
R66  44.58,22.35 0 top
R67  47.37,24.89 270 top
R68  55.88,29.34 0 top
R69  55.88,27.43 180 top
R70  57.28,24 270 top
R71  70.23,22.35 0 top
R72  73.03,24.89 270 top
R73  74.42,29.34 180 top
R74  74.42,27.43 0 top
R75  6.48,20.57 270 top
R76  7.49,17.27 270 top
R77  9.27,22.1 180 top
R78  9.78,17.27 270 top
R79  12.06,20.57 270 top
R80  12.06,17.27 270 top
R81  16.64,20.57 270 top
R82  16.64,17.27 270 top
R83  19.43,22.1 0 top
R84  19.43,17.53 0 top
R85  22.23,21.34 270 top
R86  22.23,18.03 270 top
R87  31.62,20.83 270 top
R88  32.64,17.53 270 top
R89  34.92,17.53 270 top
R90  37.21,20.83 270 top
R91  37.21,17.53 270 top
R92  41.78,20.83 270 top
R93  41.78,17.53 270 top
R94  44.58,17.78 0 top
R95  47.37,21.59 270 top
R96  47.37,18.29 270 top
R97  55.12,20.7 90 top
R98  57.28,20.7 270 top
R99  60.07,21.97 180 top
R100  60.07,17.91 180 top
R101  62.87,20.57 270 top
R102  62.87,17.27 270 top
R103  67.44,20.57 270 top
R104  67.44,17.27 270 top
R105  70.23,17.53 0 top
R106  73.03,21.59 270 top
R107  73.03,18.29 270 top
R108  40.64,76.33 0 top
R109  40.64,73.53 0 top
U1  37.34,6.22 90 bottom
U$2  39.88,80.14 0 bottom

### Tracks (layer width: path | path; a pad name or v marks a point on that pad's centre or on a via)
+3V3  (via drill 0.35)
  Top 0.203: D1.2 12.81,103.63 14.5,103.63 v14.87,103.26 D2.2 | D4.2 14.92,87.57 v14.86,87.63 | D3.2 14.8,89.47 v14.86,89.41 | R109.1 R108.1 v38.1,76.33 | v38.1,106.81 U$2.2
  Top 0.406: v13.59,46.74 11.18,44.32 10.41,44.32 5.87,39.78 5.87,38.2 2.09,34.42 JP5.8 | U$2.2 U$2.1 17.53,106.81 14.87,104.15 v14.87,103.26
  Bottom 0.203: 14.86,103.25 v14.87,103.26 | v38.1,106.81 v38.1,76.33
  Bottom 0.406: 14.86,103.25 v14.86,89.41 v14.86,87.63 13.59,86.36 v13.59,46.74
+5V  (via drill 0.35)
  Top 0.406: v73.66,106.81 U$2.96 U$2.95 v40.64,106.81 | 34.29,8.76 31.62,6.1 C59.+ | 34.29,8.76 U1.3 v40.51,8.76 | C57.1 34,9.06 34.29,8.76
  Bottom 0.406: v73.66,106.81 JP2.1 75.31,86.11 75.31,72.9 JP4.1 | v40.64,106.81 40.64,8.89 v40.51,8.76
+12V  (via drill 0.35)
  Top 0.203: IC3.5 14.95,55.32 C17.1 v10.29,54.74
  Top 0.406: IC4.4 v14.35,34.54 C21.1 | C27.1 v39.5,34.42 IC5.4 | IC6.4 v65.15,34.16 C33.1 | v11.94,13.84 v38.35,13.84 v45.34,13.84 v64.01,13.84 | IC2.8 60.13,79.56 v59.69,79.12 59.05,78.49 C8.1 | IC1.4 v10.16,94.74 C2.1 | C58.1 35.05,1.4 U1.1 40.13,3.68 45.34,8.89 D5.C
  Bottom 0.406: C61.+ 11.94,6.73 v11.94,13.84 11.94,32.13 v14.35,34.54 10.29,38.61 v10.29,54.74 10.29,94.62 v10.16,94.74 | v64.01,13.84 64.01,33.02 v65.15,34.16 65.15,43.18 60.45,47.88 60.45,78.36 v59.69,79.12 | v39.5,34.42 38.35,33.27 v38.35,13.84 | D5.C v45.34,13.84
-12V  (via drill 0.35)
  Top 0.203: IC3.2 v18.92,57.28 | C17.2 v18.92,54.74
  Top 0.406: IC4.11 v14.35,25.78 C38.1 | IC5.11 v39.5,26.04 C43.1 | IC6.11 v65.15,25.78 C48.1 | v65.02,13.08 39.75,13.08 v39.5,12.83 v16.76,12.83 v14.48,12.83 | C11.1 65.57,76.11 v65.53,76.07 64.77,75.31 IC2.4 | IC1.11 v18.92,94.74 C3.1
  Bottom 0.406: v16.76,12.83 C60.- | v65.02,13.08 65.15,13.21 v65.15,25.78 66.8,27.43 66.8,44.32 65.53,45.59 v65.53,76.07 | v39.5,26.04 v39.5,12.83 39.5,7.62 D6.A | v14.48,12.83 14.35,12.95 v14.35,25.78 18.92,30.35 v18.92,54.74 v18.92,57.28 v18.92,94.74
ADC1  (via drill 0.35)
  Top 0.203: R2.1 10.03,103.89 v10.16,103.76 | v8.89,76.33 U$2.25
  Bottom 0.203: v10.16,103.76 8.89,102.49 v8.89,76.33
ADC2  (via drill 0.35)
  Top 0.203: R11.1 7.62,87.29 v7.62,86.49 | v7.62,73.79 U$2.27
  Bottom 0.203: v7.62,86.49 v7.62,73.79
ADC3  (via drill 0.35)
  Top 0.203: R15.1 21.8,86.65 v21.84,86.61 | U$2.29 v21.46,71.25
  Bottom 0.203: v21.84,86.61 21.46,86.23 v21.46,71.25
ADC4  (via drill 0.35)
  Top 0.203: U$2.31 v16.51,68.71 | R7.1 16.76,103.89 v16.51,104.14
  Bottom 0.203: v16.51,104.14 v16.51,68.71
ADCREF
  Top 0.203: U$2.34 28.41,66.17 27.18,64.94 27.18,62.99 26.54,62.36 17.78,62.36 17.02,61.59 C16.1 R31.2
ADCREF_NEGATIVE  (via drill 0.35)
  Top 0.203: R37.2 16.55,43.18 | 16.55,43.18 16.55,43.9 v16.51,43.94 21.97,43.94 22.61,43.31 27.94,43.31 29.59,44.96 v39.5,44.96 47.62,44.96 51.82,40.77 60.36,40.77 R52.2 C31.1 63.03,44.45 69.85,44.45 v69.98,44.58 | R56.2 v69.98,40.13 | R44.2 37.13,40.47 C26.1 v39.5,41.53 40.39,42.42 R46.2 | R35.2 12.7,40.81 14.22,40.81 C20.1 16.55,43.18 | R32.1 C15.1 12.7,57.87 13.42,57.15 15.75,57.15 v16.57,56.33 IC3.1
  Bottom 0.203: v69.98,40.13 v69.98,44.58 | v39.5,44.96 v39.5,41.53 | v16.57,56.33 16.51,56.27 v16.51,43.94
AIN1P  (via drill 0.35)
  Top 0.203: R33.1 C18.1 6.86,38.39 v6.86,39.37 | U$2.35 v6.35,63.63
  Bottom 0.203: v6.35,63.63 6.35,40.77 6.86,40.26 v6.86,39.37
AIN2P  (via drill 0.35)
  Top 0.203: R40.1 v21.55,36.96 C23.1 | U$2.37 v21.46,61.09
  Bottom 0.203: v21.46,61.09 21.46,37.05 v21.55,36.96
AIN3P  (via drill 0.35)
  Top 0.203: R42.1 C24.1 32.44,38.5 v32.44,38.99 | U$2.39 27.18,59.82 v32.38,59.82
  Bottom 0.203: v32.38,59.82 32.38,39.04 v32.44,38.99
AIN4P  (via drill 0.35)
  Top 0.203: R49.1 C29.1 46.95,38.35 v46.38,38.92 | U$2.41 27.18,57.28 41.66,57.28 42.93,58.55 46.35,58.55 46.38,58.52 v46.64,58.52
  Bottom 0.203: v46.64,58.52 46.38,58.26 v46.38,38.92
AIN5P  (via drill 0.35)
  Top 0.203: R51.1 C30.1 57.66,37.89 v57.66,38.99 | U$2.43 27.18,54.74 41.66,54.74 44.2,57.28 v58.55,57.28
  Bottom 0.203: v58.55,57.28 58.55,39.88 v57.66,38.99
AIN6P  (via drill 0.35)
  Top 0.203: R58.1 v72.35,36.7 C35.1 | U$2.45 27.18,49.66 41.57,49.66 43.47,47.75 49.78,47.75 50.42,47.12 v72.39,47.12
  Bottom 0.203: v72.39,47.12 72.39,36.74 v72.35,36.7
AOUT1_N  (via drill 0.35)
  Top 0.203: U$2.66 52.58,67.44 v8.89,67.44 | v8.89,15.37 9.78,16.26 R78.2
  Bottom 0.203: v8.89,67.44 v8.89,15.37
AOUT1_P  (via drill 0.35)
  Top 0.203: R76.2 7.62,16.29 v7.62,15.37 | v7.62,69.98 32,69.98 33.27,68.71 U$2.65
  Bottom 0.203: v7.62,15.37 v7.62,69.98
AOUT2_N  (via drill 0.35)
  Top 0.203: U$2.64 52.58,64.9 v33.02,64.9 | v33.02,15.37 32.46,14.81 22.15,14.81 20.28,16.68 R84.2
  Bottom 0.203: v33.02,64.9 v33.02,15.37
AOUT2_P  (via drill 0.35)
  Top 0.203: R86.2 22.23,16 22.99,15.24 31.5,15.24 v31.75,15.49 | v31.75,66.17 U$2.63
  Bottom 0.203: v31.75,15.49 v31.75,66.17
AOUT3_N  (via drill 0.35)
  Top 0.203: U$2.62 52.58,62.36 v35.56,62.36 | v35.56,15.37 34.92,16 R89.2
  Bottom 0.203: v35.56,62.36 v35.56,15.37
AOUT3_P  (via drill 0.35)
  Top 0.203: U$2.61 v34.29,63.63 | v34.29,15.37 33.95,15.37 R88.2
  Bottom 0.203: v34.29,63.63 v34.29,15.37
AOUT4_N  (via drill 0.35)
  Top 0.203: R94.2 45.43,16.8 v45.47,16.76 | U$2.60 52.58,59.82 v45.34,59.82
  Bottom 0.203: v45.47,16.76 45.34,16.89 v45.34,59.82
AOUT4_P  (via drill 0.35)
  Top 0.203: R96.2 46.7,16.76 v46.61,16.76 | v45.97,61.09 U$2.59
  Bottom 0.203: v45.97,61.09 45.97,59.44 45.72,59.18 45.72,17.65 v46.61,16.76
AOUT5_N  (via drill 0.35)
  Top 0.203: R100.2 v55.88,17.91
  Bottom 0.203: v55.88,17.91 55.88,22.61 55.5,22.99 55.5,56.9 U$2.58
AOUT5_P  (via drill 0.35)
  Top 0.203: R97.2 v55.12,22.48
  Bottom 0.203: U$2.57 51.31,58.04 52.07,57.28 54.36,57.28 55.12,56.52 v55.12,22.48
AOUT6_N  (via drill 0.35)
  Top 0.203: R105.2 71.08,16.68 71.12,16.64 69.85,15.37 48.84,15.37 v48.51,15.69 | U$2.56 52.58,54.74 v47.75,54.74
  Bottom 0.203: v48.51,15.69 48.26,15.95 48.26,17.53 47.52,18.27 47.52,54.51 v47.75,54.74
AOUT6_P  (via drill 0.35)
  Top 0.203: R107.2 73.03,16 72.01,14.99 v48.01,14.99 | U$2.55 50.93,55.63 v47.7,55.63
  Bottom 0.203: v48.01,14.99 47.9,15.09 47.9,17.25 47.12,18.03 47.12,55.29 47.45,55.63 v47.7,55.63
AOUT7_N  (via drill 0.35)
  Top 0.203: R30.2 68.62,67.22 v68.71,67.31 | U$2.54 68.83,53.47 v68.96,53.59
  Bottom 0.203: v68.71,67.31 68.71,53.85 v68.96,53.59
AOUT7_P  (via drill 0.35)
  Top 0.203: U$2.53 52.07,53.47 53.34,54.74 v57.48,54.74 | v57.91,67.44 58.04,67.56 R26.2
  Bottom 0.203: v57.48,54.74 57.35,54.86 57.35,66.88 v57.91,67.44
AOUT8_N  (via drill 0.35)
  Top 0.203: R22.2 v67.94,81.03 | U$2.52 v67.56,50.93
  Bottom 0.203: v67.94,81.03 67.44,80.52 67.44,51.05 v67.56,50.93
AOUT8_P  (via drill 0.35)
  Top 0.203: U$2.51 51.31,51.44 52.07,52.2 v57.02,52.2 | R17.2 v57.28,86.61
  Bottom 0.203: v57.28,86.61 56.87,86.21 56.87,74.32 57.02,74.17 57.02,72.14 56.9,72.01 56.9,52.32 v57.02,52.2
CV1
  Top 0.203: JP1.5 2.03,102.78 4.24,100.57 4.24,99.05 6.64,96.65 R4.1
CV2
  Top 0.203: JP1.4 2.03,100.08 5.08,97.03 R1.1
CV3
  Top 0.203: R16.1 24.13,87 22.99,85.85 6.86,85.85 3.68,89.03 3.68,93.73 JP1.2
CV4  (via drill 0.35)
  Top 0.203: R9.1 22.61,96.77 v22.73,96.65 | v22.61,85.22 6.6,85.22 2.03,89.79 JP1.1
  Bottom 0.203: v22.73,96.65 22.61,96.52 v22.61,85.22
ENC1A  (via drill 0.35)
  Top 0.203: JP6.11 v23.11,42.04 | v22.73,83.06 23.01,83.34 25.25,83.34 25.86,83.95 U$2.19
  Bottom 0.203: v23.11,42.04 23.11,46.99 22.73,47.37 v22.73,83.06
ENC1B
  Bottom 0.203: JP6.12 27.3,82.8 U$2.20
ENC1SW  (via drill 0.35)
  Top 0.203: JP6.10 v20.12,39.5 | v20.45,105.03 24.51,105.03 25.27,104.27 U$2.3
  Bottom 0.203: v20.12,39.5 20.12,104.7 v20.45,105.03
ENC2A  (via drill 0.35)
  Top 0.203: JP7.11 52.7,42.42 49.28,45.85 v24.77,45.85
  Bottom 0.203: U$2.21 24.77,80.26 v24.77,45.85
ENC2B  (via drill 0.35)
  Top 0.203: v50.16,82.55 36.2,82.55 35.05,81.41 U$2.22
  Bottom 0.203: JP7.12 50.16,47.12 v50.16,82.55
ENC2SW  (via drill 0.35)
  Top 0.203: JP7.10 v44.7,39.5 | v44.7,100.46 27.81,100.46 26.54,99.19 U$2.7
  Bottom 0.203: v44.7,100.46 v44.7,39.5
ENC3A  (via drill 0.35)
  Top 0.203: U$2.23 v22.1,78.87 | v22.23,46.48 49.28,46.48 49.91,45.85 74.17,45.85 JP8.11
  Bottom 0.203: v22.1,78.87 22.1,46.61 v22.23,46.48
ENC3B  (via drill 0.35)
  Top 0.203: v30.48,47.12 49.53,47.12 50.16,46.48 76.07,46.48 JP8.12
  Bottom 0.203: v30.48,47.12 30.48,76.84 U$2.24
ENC3SW  (via drill 0.35)
  Top 0.203: U$2.9 27.18,95.38 54.61,95.38 55.5,94.49 66.67,94.49 v66.93,94.23 | v67.94,45.09 68.2,45.34 73.41,45.34 75.89,42.85 75.89,41.54 77.94,39.5 JP8.10
  Bottom 0.203: v66.93,94.23 66.93,46.1 v67.94,45.09
EXT_RX  (via drill 0.35)
  Top 0.203: U$2.82 54.23,88.65 64.01,88.65 v64.26,88.39
  Bottom 0.203: v64.26,88.39 BUS.P1
EXT_SCL
  Top 0.203: U$2.73 48.01,78.87 45.97,76.84 I2C.2 R108.2
EXT_SDA  (via drill 0.35)
  Top 0.203: v52.58,75.06 47.24,75.06 I2C.3 45.72,73.53 R109.2
  Bottom 0.203: v52.58,75.06 52.58,77.6 U$2.74
EXT_TX
  Top 0.203: U$2.84 BUS.P3
GND  (via drill 0.35)  (157 unrouted)
  Top 0.203: C26.2 v39.5,37.97 C27.2 | C20.2 v14.35,38.35 C21.2
  other vias: 12.7,105.54 23.5,102.87 32.26,90.93 32.26,86.49 32.26,83.95 32.26,80.77 32.26,78.87 32.26,76.33 32.26,73.79 32.38,68.45 57.4,43.31 49.66,41.53 62.87,76.96 65.28,30.35 39.5,30.86 14.35,30.86 13.84,100.2 13.84,96.01 42.67,89.03 42.67,86.49 42.67,94.11 35.05,76.33 42.67,70.74 42.67,59.82 42.67,52.2 37.59,48.39 37.59,56.01 28.7,40.77 48.64,31.5 46.35,28.57 58.8,32.77 58.8,26.04 33.66,26.67 70.48,27.94 71.75,80.77 71.63,64.39 71.63,66.93 71.75,69.22 62.74,83.82 20.45,30.99 20.45,27.05 44.45,32.77 16.64,15.37 15.11,21.72 9.53,30.86 39.37,78.87 39.24,92.2 39.24,86.49 74.8,93.98 74.8,98.3 3.43,86.61 5.21,100.08 68.96,77.47 55.75,58.8 39.24,96.01 42.67,98.42 33.78,98.42 33.78,103 42.67,103 11.43,56.26 16,59.44
  pour Bottom (isolate 0.2): -6.65,116.33 84.61,116.33 84.61,-10.67 -6.65,-10.67
  pour Top (isolate 0.2): -2.24,121.41 97.79,121.41 97.79,-5.59 -2.24,-5.59
IN1  (via drill 0.35)
  Top 0.203: v24.38,44.58 23.88,45.09 14.35,45.09 12.41,43.14 R34.2
  Bottom 0.203: v24.38,44.58 24.38,27.18 JP6.4
IN2  (via drill 0.35)
  Top 0.203: v25.02,40.77 18.5,40.77 R38.2
  Bottom 0.203: JP6.5 24.89,29.21 24.89,40.64 v25.02,40.77
IN3  (via drill 0.35)
  Top 0.203: v48.64,42.42 48.64,42.67 47.5,43.82 38.19,43.82 R43.2
  Bottom 0.203: v48.64,42.42 48.64,33.15 49.85,31.94 49.85,27.11 JP7.4
IN4  (via drill 0.35)
  Top 0.203: R47.2 49.78,40.13 v49.91,40.26
  Bottom 0.203: v49.91,40.26 49.91,33.15 50.8,32.26 50.8,28.7 JP7.5
IN5  (via drill 0.35)
  Top 0.203: R54.2 65.15,43.05 66.04,43.94 73.61,43.94 v73.99,43.56
  Bottom 0.203: v73.99,43.56 73.99,28.25 JP8.4
IN6  (via drill 0.35)
  Top 0.203: R55.2 74.55,42.42 v74.68,42.29
  Bottom 0.203: v74.68,42.29 74.55,42.16 74.55,30.23 JP8.5
LEDSW4  (via drill 0.35)
  Top 0.203: U$2.5 27.18,103 v31.11,103 | v30.48,39.5 30.48,38.82 R41.1
  Bottom 0.203: v31.11,103 31.06,102.94 31.06,40.08 v30.48,39.5
LEDSW4A
  Top 0.203: R41.2 30.31,36.96 JP6.9
LEDSW4C  (via drill 0.35)
  Top 0.203: JP6.8 v23.8,34.42
  Bottom 0.203: v23.8,34.42 23.8,46.92 24.13,47.24 24.13,89.79 U$2.13
LEDSW5  (via drill 0.35)
  Top 0.203: R50.1 55.88,38.95 56.64,39.71 v56.64,39.88 | v56.39,72.52 49.28,72.52 48.39,71.63 30.61,71.63 U$2.28
  Bottom 0.203: v56.39,72.52 56.39,40.13 v56.64,39.88
LEDSW5A
  Top 0.203: R50.2 53.17,36.49 JP7.9
LEDSW5C  (via drill 0.35)
  Top 0.203: U$2.30 28.96,70.74 34.16,70.74 34.92,69.98 v48.9,69.98
  Bottom 0.203: JP7.8 52.58,34.42 51.31,35.69 51.31,43.31 48.9,45.72 v48.9,69.98
LEDSW6  (via drill 0.35)
  Top 0.203: R59.1 71.29,41.24 v71.25,41.28 | U$2.10 v48.26,96.65 | v48.26,77.6 v57.98,77.6 | v59.69,54.74 v71.12,54.74
  Bottom 0.203: v71.25,41.28 71.12,41.4 v71.12,54.74 | v48.26,96.65 v48.26,77.6 | v57.98,77.6 57.98,75.75 59.69,74.04 v59.69,54.74
LEDSW6A
  Top 0.203: JP8.9 77.47,36.96 76.45,37.97 74.33,37.97 72.77,39.54 R59.2
LEDSW6C  (via drill 0.35)
  Top 0.203: v75.69,92.84 66.04,92.84 65.28,93.6 55.37,93.6 54.61,92.84 50.67,92.84 49.4,91.57 U$2.14
  Bottom 0.203: JP8.8 76.2,36.2 76.2,70.74 76.68,71.22 76.68,88.92 75.69,89.92 v75.69,92.84
N$1
  Top 0.203: IC4.14 20.28,25.51 C40.2 20.88,23.79 R61.2 R85.1
N$2
  Top 0.203: R82.1 R81.2 16.73,19.81 C52.2 R84.1
N$3
  Top 0.203: R83.2 C52.1 21.3,19.81 | R86.1 21.3,19.81 | R85.2 21.97,20.49 21.3,19.81
N$4
  Top 0.203: R39.1 C22.2 18.25,35.43 | 18.25,35.43 18.25,32.91 IC4.1 | R40.2 19.72,35.43 18.25,35.43
N$5
  Top 0.203: IC4.13 16.89,26.58 18.58,24.89 C40.1 R83.1
N$6
  Top 0.203: IC4.2 16.89,35.22 C22.1 R39.2 R38.1 16.55,40.97 18.25,42.67 R37.1
N$7
  Top 0.406: PWR.9 PWR.10 56.01,1.27 D6.C
N$8
  Top 0.203: IC4.12 15.62,25.49 C39.2 16.38,24.69 17.26,23.81 17.26,22.12 16.64,21.49 R81.1
N$9
  Top 0.406: PWR.1 PWR.2 57.28,11.43 D5.A
N$10
  Top 0.203: IC6.14 71.08,25.25 C50.2 71.68,24.04 R72.2 R106.1
N$11
  Top 0.203: R89.1 35.27,18.72 C53.2 35.35,19.98 R90.2 R91.1
N$12
  Top 0.203: R65.2 C53.1 31.84,20.07 31.75,19.98 R87.2 31.75,19.85 31.75,19.18 32.55,18.38 R88.1
N$13
  Top 0.203: IC5.9 36.96,26.33 C41.1 R65.1
N$14
  Top 0.203: IC5.10 38.23,25.74 C42.2 37.47,24.89 36.71,24.14 36.71,22.18 R90.1
N$15
  Top 0.203: IC5.8 33.57,25.51 C41.2 32.21,23.28 R64.2 R87.1
N$16
  Top 0.203: R95.1 R67.2 46.02,24.04 C45.2 45.43,25.53 43.33,27.63 IC5.14
N$17
  Top 0.203: IC5.7 35.69,35.47 C25.2 | C25.2 R45.1 | C25.2 R42.2
N$18
  Top 0.203: IC5.6 36.96,35.73 C25.1 R45.2 37.05,38.43 35.34,40.13 R44.1 R43.1
N$20
  Top 0.203: IC5.1 43.31,35.22 C28.2 | C28.2 R49.2 | C28.2 R48.1
N$21
  Top 0.203: IC5.2 42.04,35.47 C28.1 R48.2 R47.1 43.65,41.83 R46.1
N$22
  Top 0.203: IC6.8 59.22,25.25 C46.2 58.24,23.15 R70.2 R98.1
N$23
  Top 0.203: R94.1 C54.2 41.87,20.07 R92.2 R93.1
N$24
  Top 0.203: R66.2 C54.1 46.35,19.14 R96.1 R95.2
N$25
  Top 0.203: IC5.13 42.04,26.67 43.73,24.98 C45.1 R66.1
N$26
  Top 0.203: IC5.12 40.77,25.74 C44.2 42.28,24.23 42.28,22.18 R92.1
N$27
  Top 0.203: R32.2 13.12,61.43 14.82,59.73 R31.1 14.95,59.69 IC3.4
N$28
  Top 0.203: IC2.1 60.96,72.35 C9.2 59.14,72.14 R23.2 58.71,71.71 R25.1
N$29
  Top 0.203: C14.2 R28.2 R29.1 R30.1
N$30
  Top 0.203: Q1.1 29.53,31.14 R62.2 R63.1
N$31
  Top 0.203: C14.1 63.75,67.22 | 63.75,67.22 R27.2 | R25.2 R26.1 63.41,67.56 63.75,67.22
N$32
  Top 0.203: IC2.7 62.02,79.78 C10.2 60.2,82.04 | R24.2 60.2,82.04 | R18.1 60.11,83.95 60.11,82.13 60.2,82.04
N$35
  Top 0.203: C55.2 62.65,19.94 R101.2 R102.1 62.65,17.91 R100.1
N$36
  Top 0.203: R99.2 C55.1 59.13,19.85 R98.2 R97.1
N$37
  Top 0.203: IC6.9 62.61,26.42 60.92,24.73 C46.1 R99.1
N$38
  Top 0.203: IC6.10 63.88,25.49 C47.2 62.23,23.84 62.23,22.06 R101.1
N$39
  Top 0.203: IC4.8 8.42,25.51 C36.2 7.06,23.03 R60.2 R75.1
N$40
  Top 0.203: Q2.1 56.73,29.48 R68.2 R69.1
N$41
  Top 0.203: IC6.7 61.34,35.22 C32.2 | C32.2 R51.2 | C32.2 R53.1
N$42
  Top 0.203: IC6.6 62.61,35.47 C32.1 R53.2 | R53.2 R52.1 | R53.2 63.63,38.77 R54.1
N$44
  Top 0.203: IC6.1 68.96,35.47 C34.2 | R58.2 C34.2 | C34.2 R57.1
N$45
  Top 0.203: IC6.2 67.69,35.22 C34.1 R57.2 R56.1 R55.1
N$47
  Top 0.203: C56.2 69.38,19.94 | 69.38,19.94 R105.1 | R104.1 67.56,18.12 67.56,19.6 R103.2 69.17,19.72 69.38,19.94
N$48
  Top 0.203: R71.2 C56.1 72.01,19.14 R107.1 R106.2
N$49
  Top 0.203: IC6.13 67.69,26.33 C50.1 R71.1
N$50
  Top 0.203: IC6.12 66.42,25.49 C49.2 68.07,23.84 68.07,22.06 R103.1
N$52
  Top 0.203: IC1.6 11.05,92.2 10.29,92.96 9.56,92.96 R12.1 C5.1 6.05,92.92 R1.2
N$57
  Top 0.203: C1.1 R5.1 9.14,98.08 9.14,96.65 | IC1.2 10.61,97.28 9.97,96.65 9.14,96.65 | 9.14,96.65 R4.2
N$59
  Top 0.203: Q3.1 73.57,31.06 R73.2 R74.1
N$60
  Top 0.203: IC2.2 62.23,72.35 C9.1 62.45,69.01 R27.1
N$61
  Top 0.203: IC2.3 63.5,73.11 R28.1 65.17,73.01 65.32,73.16 C13.2
N$63
  Top 0.203: C7.2 R20.2 R22.1 R21.1
N$64
  Top 0.203: R18.2 61.34,84.67 61.43,84.76 R17.1 63.28,86.61 R19.2 C7.1
N$65
  Top 0.203: IC2.6 63.67,79.73 63.67,82.09 C10.1 63.72,85.17 R19.1
N$66
  Top 0.203: IC2.5 64.84,79.63 | 64.84,79.63 C12.2 | R20.1 64.84,81.13 64.84,79.63
N$68
  Top 0.203: IC1.1 11.14,98.55 R5.2 C1.2 7.41,100.58 R3.2
N$69
  Top 0.203: D1.3 11.56,100.25 10.2,101.6 9.36,101.6 R3.1 9.11,101.98 7.41,103.68 R2.2
N$70
  Top 0.203: IC1.7 9.82,90.93 R12.2 C5.2 7.41,91.06 R10.2
N$71
  Top 0.203: R10.1 10.12,88.52 | 10.12,88.52 D3.3 | R11.2 10.12,88.52
N$72
  Top 0.203: IC1.9 17.33,92.33 19.09,92.33 R13.1 C6.1 R16.2
N$73
  Top 0.203: IC1.8 19.39,90.93 R13.2 C6.2 21.8,91.06 R14.2
N$74
  Top 0.203: R15.2 19.09,88.52 | 19.09,88.52 D4.3 | R14.1 19.09,88.52
N$75
  Top 0.203: C4.1 R6.1 20.11,98.04 R9.2 19.09,96.77 18.58,97.28 IC1.13
N$76
  Top 0.203: 21.84,100.16 R6.2 19.3,100.16 17.69,98.55 IC1.14 | 21.84,100.16 C4.2 | R8.2 21.84,101.56 21.84,100.16
N$77
  Top 0.203: D2.3 17.53,100.25 18.88,101.6 19.6,101.6 R8.1 19.85,101.98 21.55,103.68 R7.2
N$78  (via drill 0.35)
  Top 0.203: v72.39,105.54 52.07,105.54 51.31,104.78 U$2.93
  Bottom 0.203: JP2.2 72.39,86.49 v72.39,105.54
N$79  (via drill 0.35)
  Top 0.203: U$2.91 52.58,103 v71.63,103
  Bottom 0.203: v71.63,103 71.88,102.74 71.88,84.45 JP2.3
N$80  (via drill 0.35)
  Top 0.203: U$2.89 52.58,100.46 v71.25,100.46
  Bottom 0.203: v71.25,100.46 71.37,100.33 71.37,82.42 JP2.4
N$81  (via drill 0.35)
  Top 0.203: U$2.87 52.58,97.92 v70.74,97.92
  Bottom 0.203: v70.74,97.92 70.87,97.79 70.87,79.88 73.15,77.6 JP2.5
N$82  (via drill 0.35)
  Top 0.203: U$2.88 v68.56,96.65
  Bottom 0.203: v68.56,96.65 68.56,79.14 69.98,77.72 69.98,64.77 JP4.5
N$83  (via drill 0.35)
  Top 0.203: U$2.90 v68.89,99.19
  Bottom 0.203: v68.89,99.19 69.14,98.93 69.14,79.32 70.48,77.98 70.48,66.8 JP4.4
N$84  (via drill 0.35)
  Top 0.203: U$2.92 v69.47,101.73
  Bottom 0.203: v69.47,101.73 69.6,101.6 69.6,79.5 70.99,78.11 70.99,68.83 JP4.3
N$85  (via drill 0.35)
  Top 0.203: U$2.94 v69.85,104.27
  Bottom 0.203: JP4.2 71.5,70.87 71.5,78.36 70.1,79.76 70.1,104.01 v69.85,104.27
N$214
  Top 0.203: R78.1 10.12,18.46 C51.2 10.21,19.72 R79.2 R80.1
N$215
  Top 0.203: R77.2 C51.1 8.33,19.72 R75.2 6.48,19.14 R76.1
N$216
  Top 0.203: IC4.9 11.81,26.67 10.12,24.98 C36.1 R77.1
N$217
  Top 0.203: IC4.10 13.08,25.49 C37.2 11.43,23.84 11.43,22.06 R79.1
N$220
  Top 0.203: IC4.7 10.54,35.65 C19.2 | C19.2 R33.2 | C19.2 R36.1
N$223
  Top 0.203: IC4.6 11.81,35.22 C19.1 R36.2 10.71,39.8 R35.1 R34.1
OLED_BLK  (via drill 0.35)
  Top 0.203: v6.35,81.99 24.45,81.99 25.14,82.68 34.8,82.68 36.07,83.95 U$2.77
  Bottom 0.203: JP5.2 5.44,22.58 5.44,74.17 6.24,74.97 6.24,81.88 v6.35,81.99
OLED_CS  (via drill 0.35)
  Top 0.203: U$2.75 36.58,81.41 35.31,80.14 v5.66,80.14
  Bottom 0.203: JP5.3 5.08,24.77 5.08,74.32 5.56,74.8 5.56,80.04 v5.66,80.14
OLED_DC  (via drill 0.35)
  Top 0.203: v5.08,83.95 24.47,83.95 25.74,85.22 52.58,85.22 U$2.78
  Bottom 0.203: JP5.4 4.7,26.92 4.7,74.44 5.07,74.82 v5.07,83.94 v5.08,83.95
OLED_MOSI  (via drill 0.35)
  Top 0.203: U$2.76 52.58,80.14 36.96,80.14 34.42,77.6 v4.14,77.6
  Bottom 0.203: JP5.6 3.91,31.22 3.91,77.37 v4.14,77.6
OLED_RST  (via drill 0.35)
  Top 0.203: U$2.69 48.26,73.79 46.99,72.52 36.83,72.52 34.29,75.06 v4.49,75.06
  Bottom 0.203: JP5.5 4.27,29.03 4.27,74.83 v4.49,75.06
OLED_SCK  (via drill 0.35)
  Top 0.203: v3.56,84.64 24.37,84.64 24.64,84.9 24.64,87 25.4,87.76 52.58,87.76 U$2.80
  Bottom 0.203: JP5.7 3.56,33.4 v3.56,84.64
OUT1  (via drill 0.35)
  Top 0.203: R23.1 59.02,73.79 v56.39,73.79 | JP3.4 76.2,98.68 76.2,98.04 74.17,96.01 v56.39,96.01
  Bottom 0.203: v56.39,96.01 v56.39,73.79
OUT2  (via drill 0.35)
  Top 0.203: R24.1 58.46,83.1 v58.55,83.19 | JP3.2 v58.55,95.38
  Bottom 0.203: v58.55,83.19 v58.55,95.38
OUT3  (via drill 0.35)
  Top 0.203: R60.1 6.48,26.42 9.91,29.85 22.86,29.85 v23.11,29.59
  Bottom 0.203: v23.11,29.59 23.11,27.18 25.4,24.89 25.4,23.62 JP6.3
OUT4  (via drill 0.35)
  Top 0.203: R61.1 23.15,25.49 v23.62,25.02
  Bottom 0.203: v23.62,25.02 23.62,22.86 JP6.2
OUT5  (via drill 0.35)
  Top 0.203: R64.1 31.62,25.65 35.81,29.85 v48.64,29.85
  Bottom 0.203: JP7.3 48.64,25.78 v48.64,29.85
OUT6  (via drill 0.35)
  Top 0.203: v48.67,24.16 48.42,24.42 48.42,25.05 47.73,25.74 R67.1
  Bottom 0.203: v48.67,24.16 48.67,23.21 JP7.2
OUT7  (via drill 0.35)
  Top 0.203: v72.39,29.34 60.96,29.34 57.28,25.65 R70.1
  Bottom 0.203: JP8.3 72.39,27.3 v72.39,29.34
OUT8
  Top 0.203: JP8.2 74.93,22.23 74.93,24.26 73.44,25.74 R72.1
SW1  (via drill 0.35)
  Top 0.203: U$2.4 27.18,105.54 25.08,105.54 24.88,105.74 19.07,105.74 v17.95,104.61 | v17.78,50.93 10.92,50.93 JP5.11
  Bottom 0.203: v17.95,104.61 17.82,104.48 17.82,50.97 v17.78,50.93
SW2  (via drill 0.35)
  Top 0.203: U$2.6 28.07,101.35 27.6,101.35 26.71,100.46 23.58,100.46 22.69,101.35 v22.61,101.35 | JP5.10 12.19,49.66 v20.83,49.66
  Bottom 0.203: v22.61,101.35 21.72,100.46 21.59,100.46 21.59,87.76 20.83,87 v20.83,49.66
SW3  (via drill 0.35)
  Top 0.203: U$2.8 27.18,97.92 v23.44,97.92 | v23.37,48.39 13.21,48.39 2.03,37.21 JP5.9
  Bottom 0.203: v23.44,97.92 23.37,97.84 v23.37,48.39
SW4  (via drill 0.35)
  Top 0.203: JP6.7 28.56,31.88 28.93,32.24 33.69,32.24 v33.71,32.26 | v33.71,94.05 28.5,94.05 U$2.12
  Bottom 0.203: v33.71,32.26 v33.71,94.05
SW5  (via drill 0.35)
  Top 0.203: v49.02,92.84 27.18,92.84 U$2.11
  Bottom 0.203: JP7.7 50.8,33.78 50.8,43.05 48.39,45.47 48.39,69.09 48.26,69.22 48.26,70.23 48.9,70.87 48.9,92.71 v49.02,92.84
SW6  (via drill 0.35)
  Top 0.203: v74.93,90.17 74.8,90.3 66.29,90.3 65.53,89.53 59.56,89.53 58.8,90.3 27.56,90.3 27.43,90.17 v27.3,90.17
  Bottom 0.203: JP8.7 75.82,34.04 75.82,70.87 76.33,71.37 76.33,88.77 v74.93,90.17 | v27.3,90.17 27.3,87.88 U$2.17
TR1  (via drill 0.35)
  Top 0.203: Q1.3 v30.48,34.67
  Bottom 0.203: v30.48,34.67 30.48,34.87 29.9,35.45 29.9,75.26 28.83,76.33 U$2.26
TR1_OUT
  Top 0.203: R62.1 JP6.6
TR2  (via drill 0.35)
  Top 0.203: v56.13,34.67 55.88,34.42 Q2.3
  Bottom 0.203: U$2.83 52.58,90.3 54.36,90.3 55.12,89.53 55.12,58.42 55.88,57.66 55.88,34.93 v56.13,34.67
TR2_OUT
  Top 0.203: R68.1 JP7.6
TR3  (via drill 0.35)
  Top 0.203: Q3.3 74.42,33.66 v73.41,34.67 | v73.41,49.66 v49.53,49.66
  Bottom 0.203: v73.41,49.66 v73.41,34.67 | U$2.81 49.53,87.25 v49.53,49.66
TR3_OUT
  Top 0.203: R73.1 JP8.6

### Text on the board
bPlace: Xibeca Modular | Rev03 | Rebel Technology | GND | SCL | SDA | -12V